# Altium project Motherboard_CMOS_MTJ_Biochip_v1.PrjPCB (part 1 of 2)
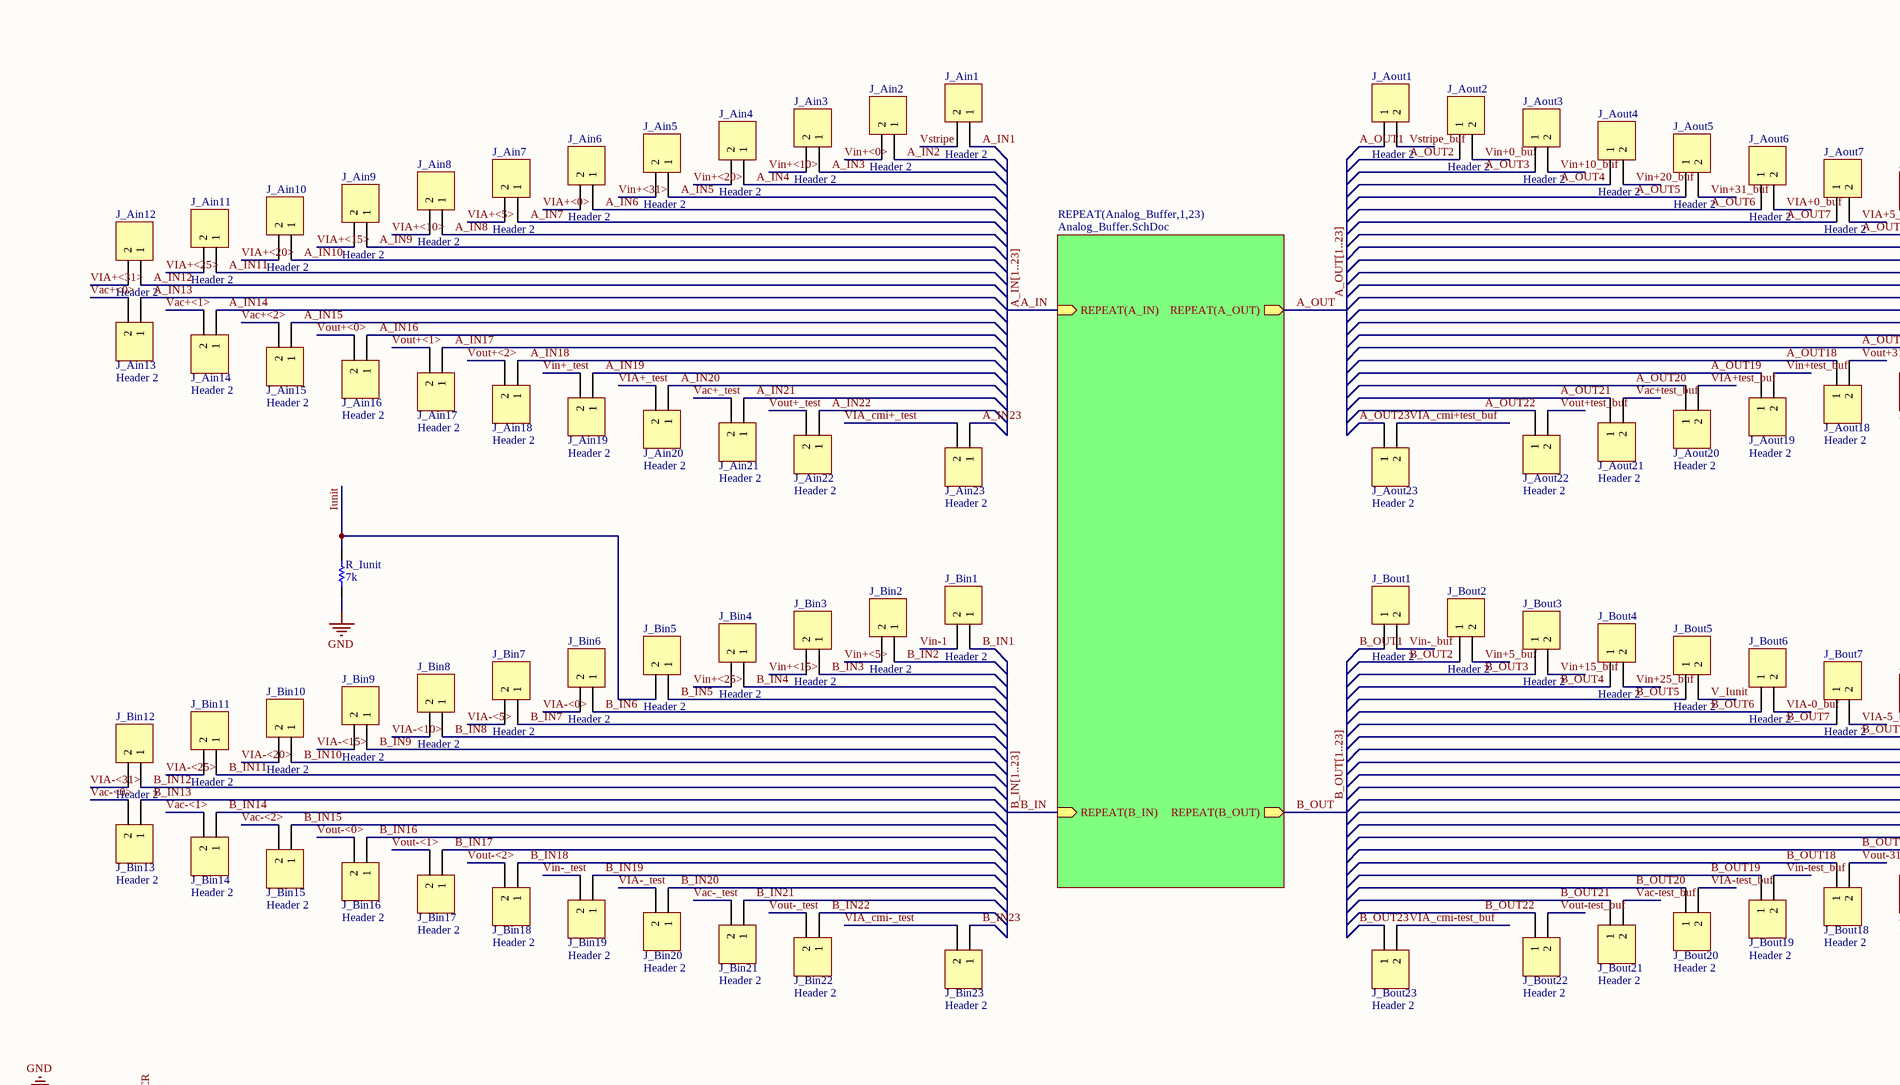
[diagram p0: Top.SchDoc, top left]
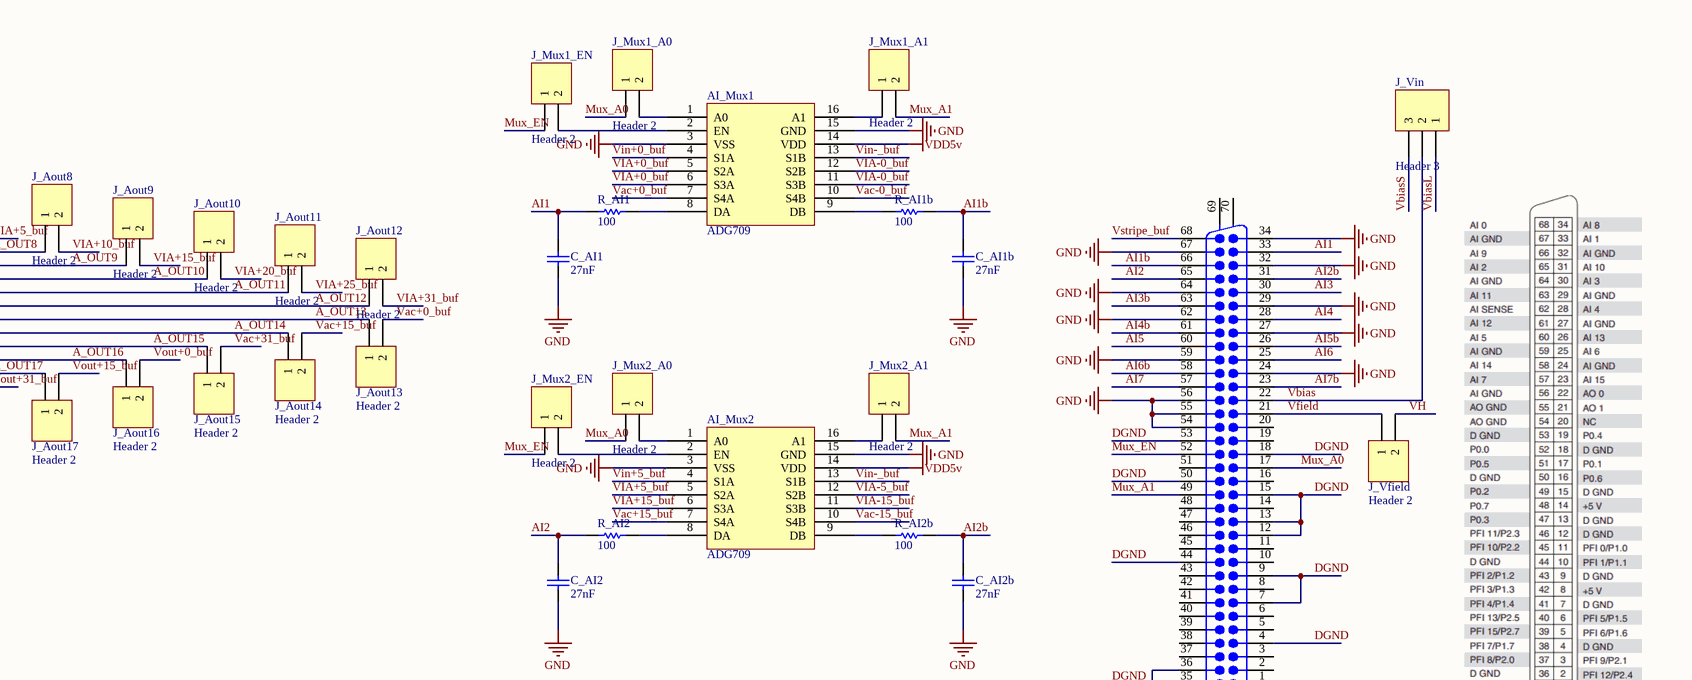
[diagram p1: Top.SchDoc, top right]
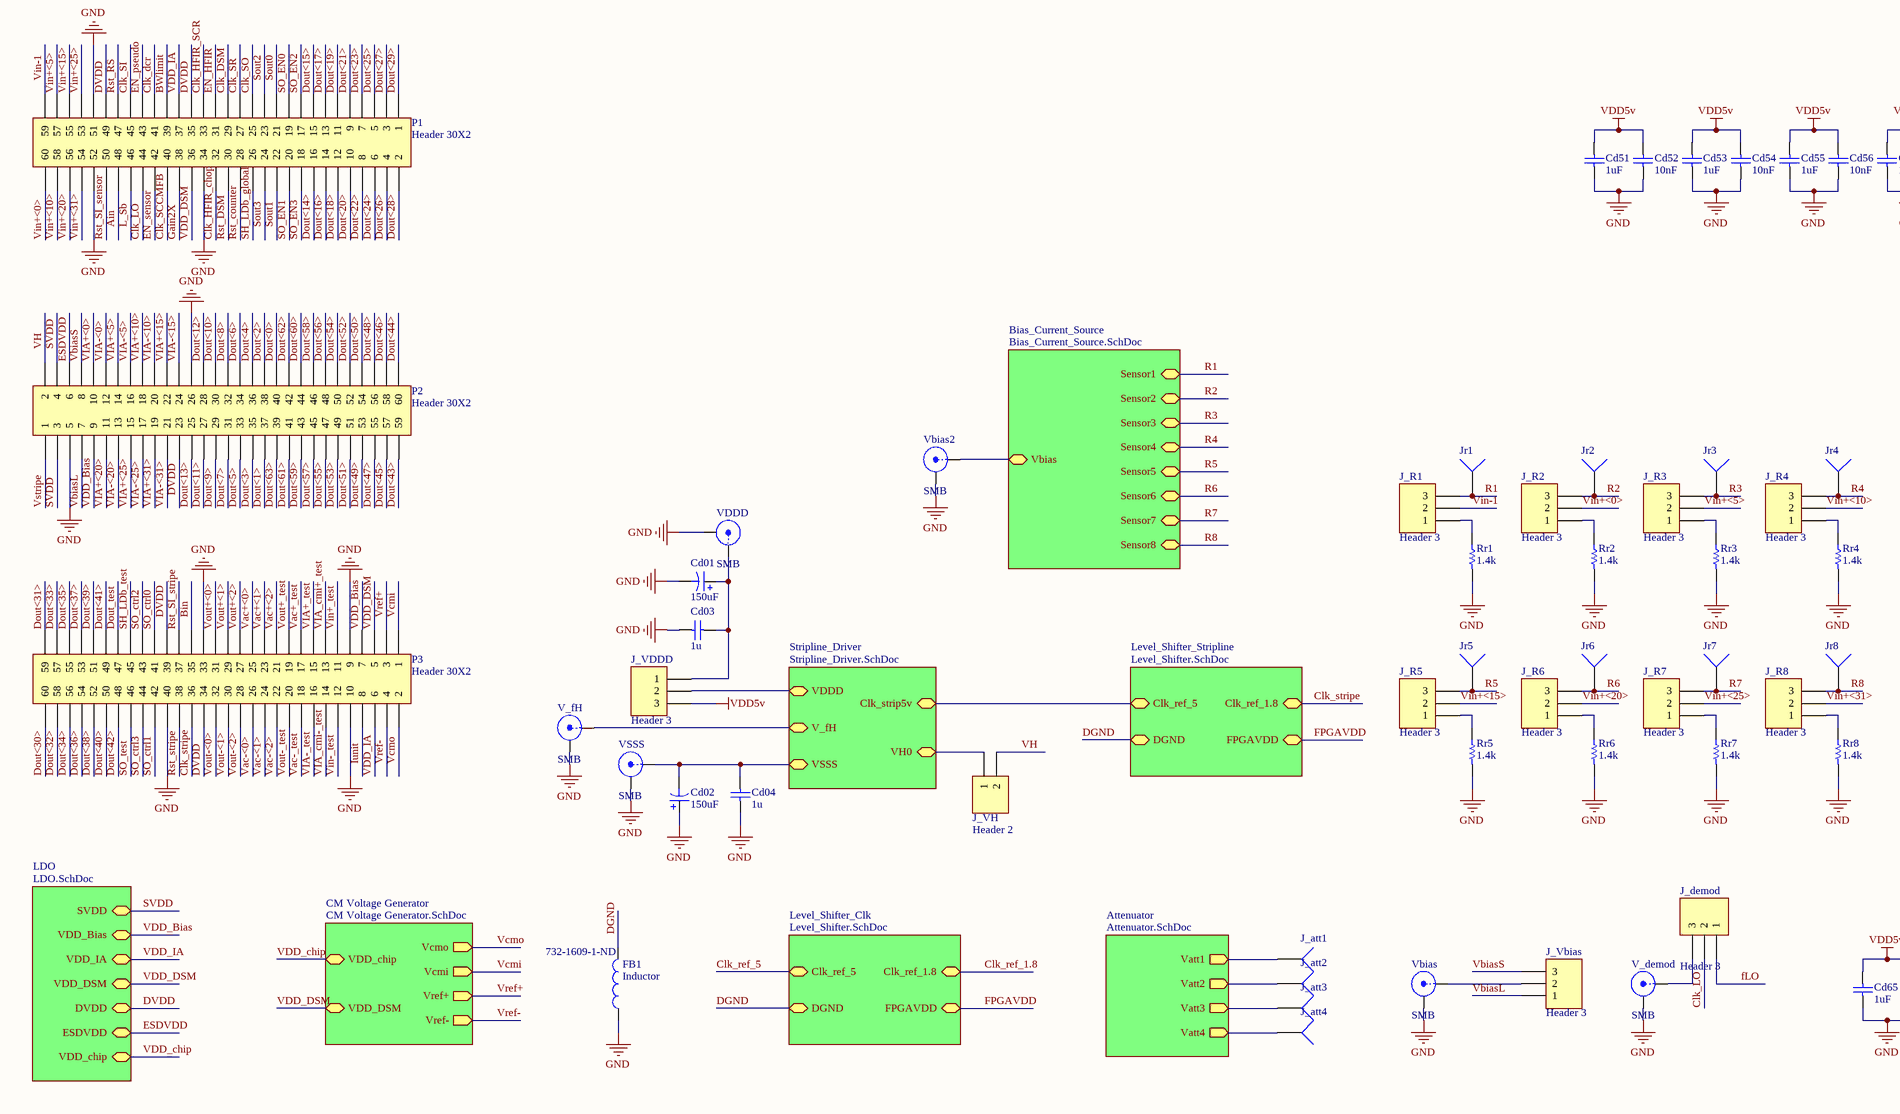
[diagram p2: Top.SchDoc, bottom left]
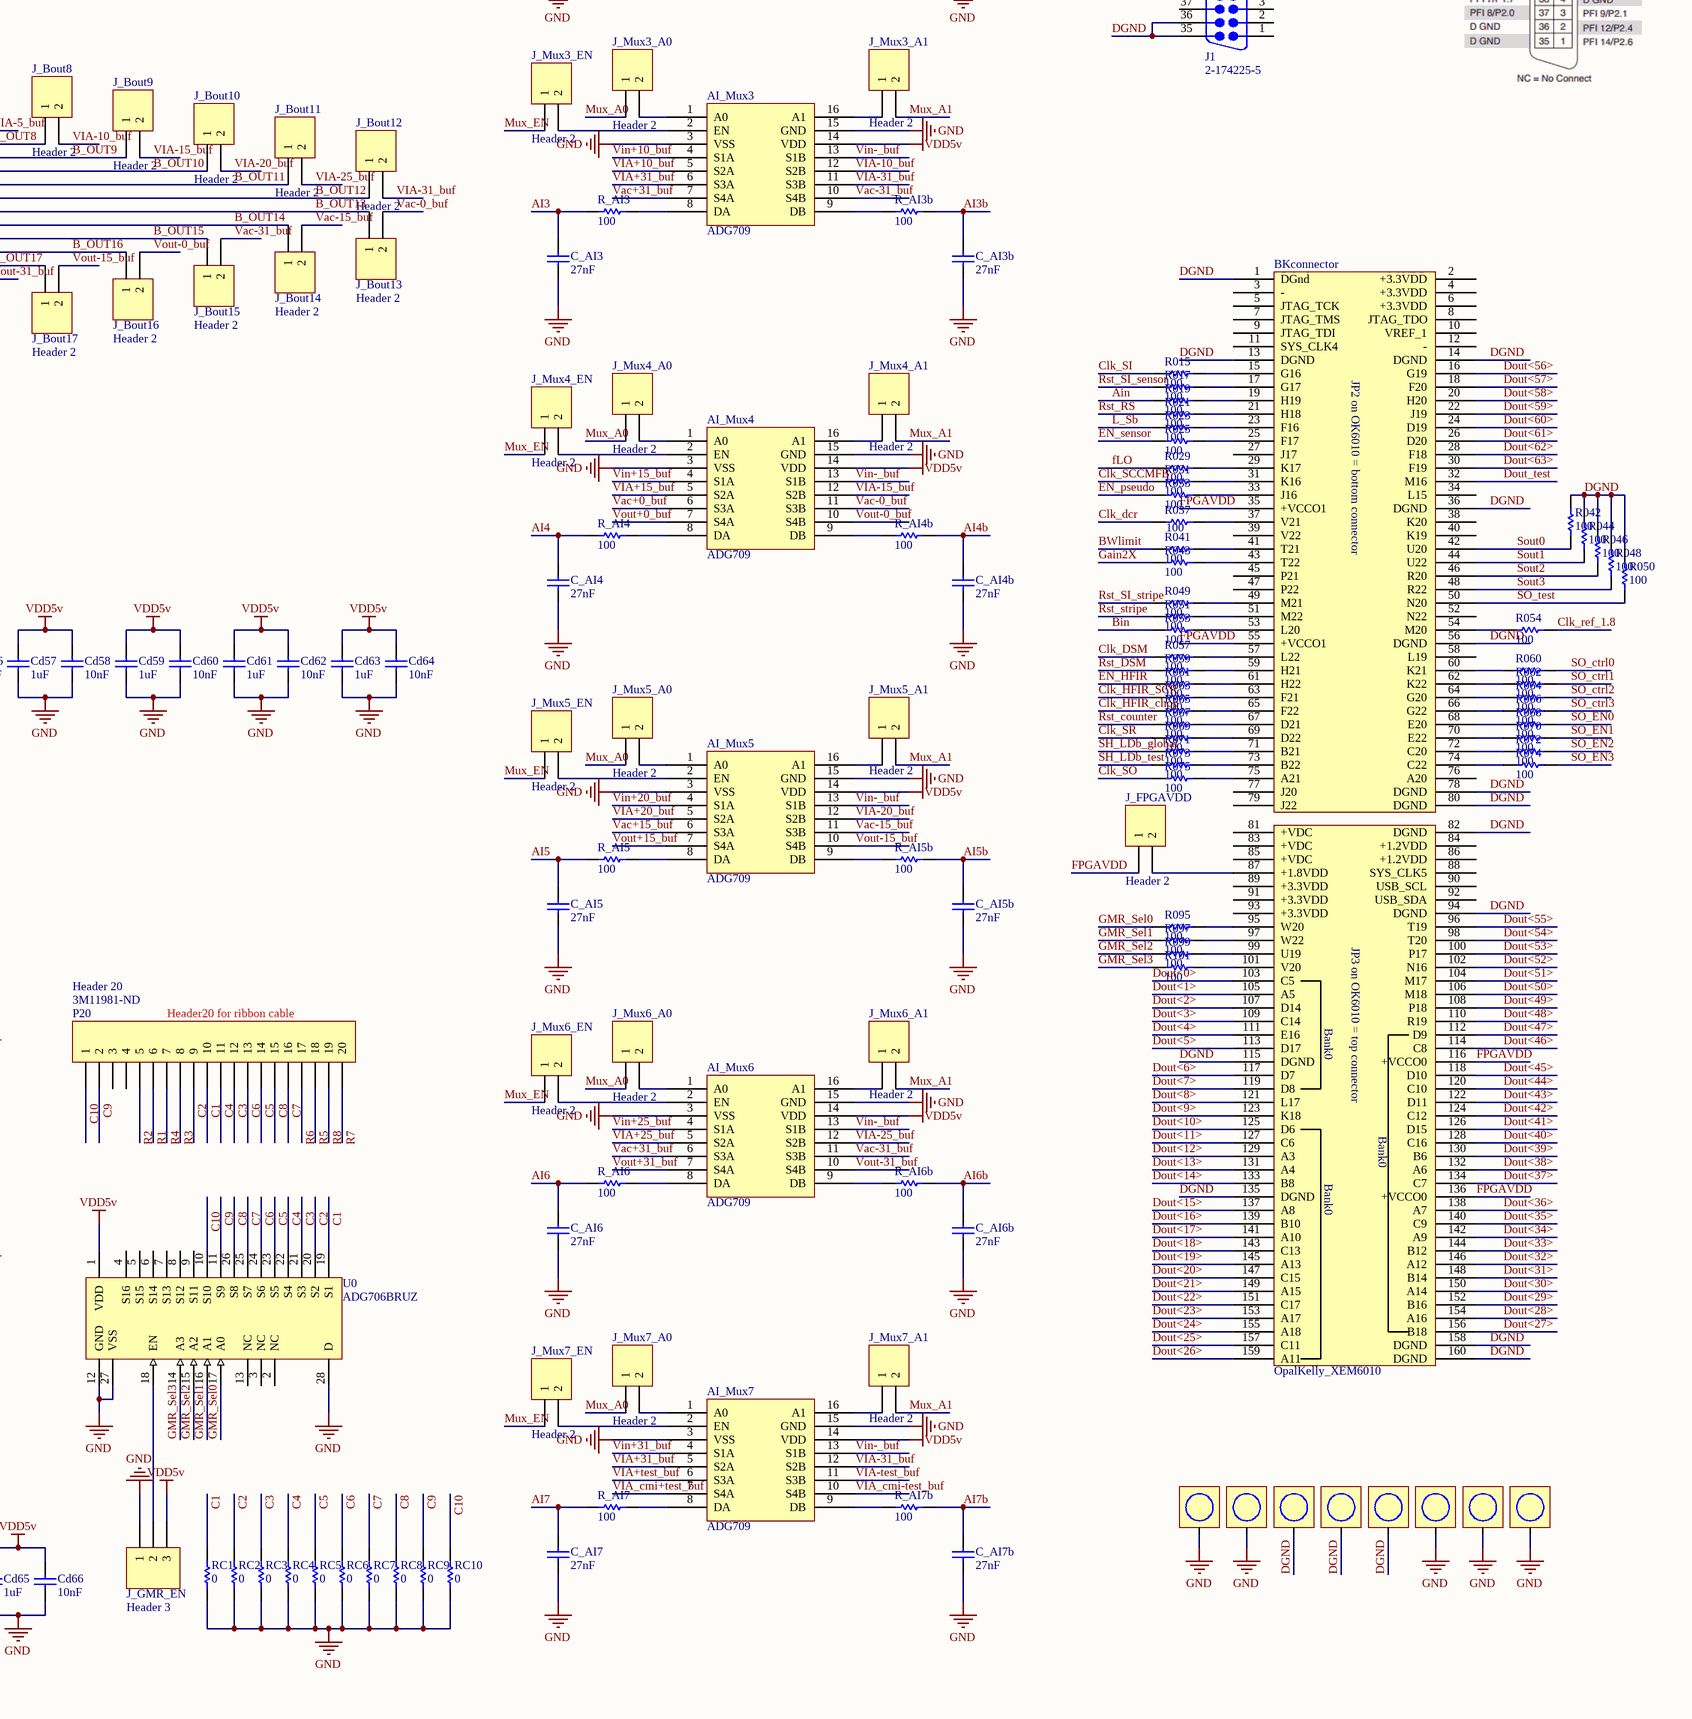
[diagram p3: Top.SchDoc, bottom right]
8 sheets, 647 parts. Net scope: hierarchical (ports join the sheet entries above them; power ports are global).
Board file: Motherboard_CMOS_MTJ_Biochip_v1.PcbDoc
Sheets:
  Top.SchDoc
    LDO = LDO.SchDoc
    CM Voltage Generator = CM Voltage Generator.SchDoc
    Level_Shifter_Clk = Level_Shifter.SchDoc
    Analog_Buffer1 = Analog_Buffer.SchDoc
    Analog_Buffer2 = Analog_Buffer.SchDoc
    Analog_Buffer3 = Analog_Buffer.SchDoc
    Analog_Buffer4 = Analog_Buffer.SchDoc
    Analog_Buffer5 = Analog_Buffer.SchDoc
    Analog_Buffer6 = Analog_Buffer.SchDoc
    Analog_Buffer7 = Analog_Buffer.SchDoc
    Analog_Buffer8 = Analog_Buffer.SchDoc
    Analog_Buffer9 = Analog_Buffer.SchDoc
    Analog_Buffer10 = Analog_Buffer.SchDoc
    Analog_Buffer11 = Analog_Buffer.SchDoc
    Analog_Buffer12 = Analog_Buffer.SchDoc
    Analog_Buffer13 = Analog_Buffer.SchDoc
    Analog_Buffer14 = Analog_Buffer.SchDoc
    Analog_Buffer15 = Analog_Buffer.SchDoc
    Analog_Buffer16 = Analog_Buffer.SchDoc
    Analog_Buffer17 = Analog_Buffer.SchDoc
    Analog_Buffer18 = Analog_Buffer.SchDoc
    Analog_Buffer19 = Analog_Buffer.SchDoc
    Analog_Buffer20 = Analog_Buffer.SchDoc
    Analog_Buffer21 = Analog_Buffer.SchDoc
    Analog_Buffer22 = Analog_Buffer.SchDoc
    Analog_Buffer23 = Analog_Buffer.SchDoc
    Attenuator = Attenuator.SchDoc
    Stripline_Driver = Stripline_Driver.SchDoc
    Level_Shifter_Stripline = Level_Shifter.SchDoc
    Bias_Current_Source = Bias_Current_Source.SchDoc

## Sheet Top.SchDoc
size 711 x 457 mm

### Parts
AI_Mux1  ADG709  [RU-16]
AI_Mux2  ADG709  [RU-16]
AI_Mux3  ADG709  [RU-16]
AI_Mux4  ADG709  [RU-16]
AI_Mux5  ADG709  [RU-16]
AI_Mux6  ADG709  [RU-16]
AI_Mux7  ADG709  [RU-16]
BKconnector  OpalKelly_XEM6010  [OpalKelly_XEM6010]
C_AI1  value 27nF  [1608[0603]]  (hidden comment: Cap)
C_AI1b  value 27nF  [1608[0603]]  (hidden comment: Cap)
C_AI2  value 27nF  [1608[0603]]  (hidden comment: Cap)
C_AI2b  value 27nF  [1608[0603]]  (hidden comment: Cap)
C_AI3  value 27nF  [1608[0603]]  (hidden comment: Cap)
C_AI3b  value 27nF  [1608[0603]]  (hidden comment: Cap)
C_AI4  value 27nF  [1608[0603]]  (hidden comment: Cap)
C_AI4b  value 27nF  [1608[0603]]  (hidden comment: Cap)
C_AI5  value 27nF  [1608[0603]]  (hidden comment: Cap)
C_AI5b  value 27nF  [1608[0603]]  (hidden comment: Cap)
C_AI6  value 27nF  [1608[0603]]  (hidden comment: Cap)
C_AI6b  value 27nF  [1608[0603]]  (hidden comment: Cap)
C_AI7  value 27nF  [1608[0603]]  (hidden comment: Cap)
C_AI7b  value 27nF  [1608[0603]]  (hidden comment: Cap)
Cd01  value 150uF  [C1210_M]  (hidden comment: Cap Pol1)
Cd02  value 150uF  [C1210_M]  (hidden comment: Cap Pol1)
Cd03  value 1u  [6-0805_M]  (hidden comment: Cap)
Cd04  value 1u  [6-0805_M]  (hidden comment: Cap)
Cd51  value 1uF  [1608[0603]]  (hidden comment: Cap)
Cd52  value 10nF  [1608[0603]]  (hidden comment: Cap)
Cd53  value 1uF  [1608[0603]]  (hidden comment: Cap)
Cd54  value 10nF  [1608[0603]]  (hidden comment: Cap)
Cd55  value 1uF  [1608[0603]]  (hidden comment: Cap)
Cd56  value 10nF  [1608[0603]]  (hidden comment: Cap)
Cd57  value 1uF  [1608[0603]]  (hidden comment: Cap)
Cd58  value 10nF  [1608[0603]]  (hidden comment: Cap)
Cd59  value 1uF  [1608[0603]]  (hidden comment: Cap)
Cd60  value 10nF  [1608[0603]]  (hidden comment: Cap)
Cd61  value 1uF  [1608[0603]]  (hidden comment: Cap)
Cd62  value 10nF  [1608[0603]]  (hidden comment: Cap)
Cd63  value 1uF  [1608[0603]]  (hidden comment: Cap)
Cd64  value 10nF  [1608[0603]]  (hidden comment: Cap)
Cd65  value 1uF  [1608[0603]]  (hidden comment: Cap)
Cd66  value 10nF  [1608[0603]]  (hidden comment: Cap)
FB1  Inductor  Supplier Part Number 1: 732-1609-1-ND  [C0805]
H1  Mounting Hole  [MTHole]  (value not drawn)
H2  Mounting Hole  [MTHole]  (value not drawn)
H3  Mounting Hole  [MTHole]  (value not drawn)
H4  Mounting Hole  [MTHole]  (value not drawn)
H5  Mounting Hole  [MTHole]  (value not drawn)
H6  Mounting Hole  [MTHole]  (value not drawn)
H7  Mounting Hole  [MTHole]  (value not drawn)
H8  Mounting Hole  [MTHole]  (value not drawn)
J1  2-174225-5  [2-174225-5]
J_Ain1  Header 2  [HDR1X2]
J_Ain2  Header 2  [HDR1X2]
J_Ain3  Header 2  [HDR1X2]
J_Ain4  Header 2  [HDR1X2]
J_Ain5  Header 2  [HDR1X2]
J_Ain6  Header 2  [HDR1X2]
J_Ain7  Header 2  [HDR1X2]
J_Ain8  Header 2  [HDR1X2]
J_Ain9  Header 2  [HDR1X2]
J_Ain10  Header 2  [HDR1X2]
J_Ain11  Header 2  [HDR1X2]
J_Ain12  Header 2  [HDR1X2]
J_Ain13  Header 2  [HDR1X2]
J_Ain14  Header 2  [HDR1X2]
J_Ain15  Header 2  [HDR1X2]
J_Ain16  Header 2  [HDR1X2]
J_Ain17  Header 2  [HDR1X2]
J_Ain18  Header 2  [HDR1X2]
J_Ain19  Header 2  [HDR1X2]
J_Ain20  Header 2  [HDR1X2]
J_Ain21  Header 2  [HDR1X2]
J_Ain22  Header 2  [HDR1X2]
J_Ain23  Header 2  [HDR1X2]
J_Aout1  Header 2  [HDR1X2]
J_Aout2  Header 2  [HDR1X2]
J_Aout3  Header 2  [HDR1X2]
J_Aout4  Header 2  [HDR1X2]
J_Aout5  Header 2  [HDR1X2]
J_Aout6  Header 2  [HDR1X2]
J_Aout7  Header 2  [HDR1X2]
J_Aout8  Header 2  [HDR1X2]
J_Aout9  Header 2  [HDR1X2]
J_Aout10  Header 2  [HDR1X2]
J_Aout11  Header 2  [HDR1X2]
J_Aout12  Header 2  [HDR1X2]
J_Aout13  Header 2  [HDR1X2]
J_Aout14  Header 2  [HDR1X2]
J_Aout15  Header 2  [HDR1X2]
J_Aout16  Header 2  [HDR1X2]
J_Aout17  Header 2  [HDR1X2]
J_Aout18  Header 2  [HDR1X2]
J_Aout19  Header 2  [HDR1X2]
J_Aout20  Header 2  [HDR1X2]
J_Aout21  Header 2  [HDR1X2]
J_Aout22  Header 2  [HDR1X2]
J_Aout23  Header 2  [HDR1X2]
J_att1  Socket  [PIN1]  (value not drawn)
J_att2  Socket  [PIN1]  (value not drawn)
J_att3  Socket  [PIN1]  (value not drawn)
J_att4  Socket  [PIN1]  (value not drawn)
J_Bin1  Header 2  [HDR1X2]
J_Bin2  Header 2  [HDR1X2]
J_Bin3  Header 2  [HDR1X2]
J_Bin4  Header 2  [HDR1X2]
J_Bin5  Header 2  [HDR1X2]
J_Bin6  Header 2  [HDR1X2]
J_Bin7  Header 2  [HDR1X2]
J_Bin8  Header 2  [HDR1X2]
J_Bin9  Header 2  [HDR1X2]
J_Bin10  Header 2  [HDR1X2]
J_Bin11  Header 2  [HDR1X2]
J_Bin12  Header 2  [HDR1X2]
J_Bin13  Header 2  [HDR1X2]
J_Bin14  Header 2  [HDR1X2]
J_Bin15  Header 2  [HDR1X2]
J_Bin16  Header 2  [HDR1X2]
J_Bin17  Header 2  [HDR1X2]
J_Bin18  Header 2  [HDR1X2]
J_Bin19  Header 2  [HDR1X2]
J_Bin20  Header 2  [HDR1X2]
J_Bin21  Header 2  [HDR1X2]
J_Bin22  Header 2  [HDR1X2]
J_Bin23  Header 2  [HDR1X2]
J_Bout1  Header 2  [HDR1X2]
J_Bout2  Header 2  [HDR1X2]
J_Bout3  Header 2  [HDR1X2]
J_Bout4  Header 2  [HDR1X2]
J_Bout5  Header 2  [HDR1X2]
J_Bout6  Header 2  [HDR1X2]
J_Bout7  Header 2  [HDR1X2]
J_Bout8  Header 2  [HDR1X2]
J_Bout9  Header 2  [HDR1X2]
J_Bout10  Header 2  [HDR1X2]
J_Bout11  Header 2  [HDR1X2]
J_Bout12  Header 2  [HDR1X2]
J_Bout13  Header 2  [HDR1X2]
J_Bout14  Header 2  [HDR1X2]
J_Bout15  Header 2  [HDR1X2]
J_Bout16  Header 2  [HDR1X2]
J_Bout17  Header 2  [HDR1X2]
J_Bout18  Header 2  [HDR1X2]
J_Bout19  Header 2  [HDR1X2]
J_Bout20  Header 2  [HDR1X2]
J_Bout21  Header 2  [HDR1X2]
J_Bout22  Header 2  [HDR1X2]
J_Bout23  Header 2  [HDR1X2]
J_demod  Header 3  [HDR1X3]
J_FPGAVDD  Header 2  [HDR1X2]
J_GMR_EN  Header 3  [HDR1X3]
J_Mux1_A0  Header 2  [HDR1X2]
J_Mux1_A1  Header 2  [HDR1X2]
J_Mux1_EN  Header 2  [HDR1X2]
J_Mux2_A0  Header 2  [HDR1X2]
J_Mux2_A1  Header 2  [HDR1X2]
J_Mux2_EN  Header 2  [HDR1X2]
J_Mux3_A0  Header 2  [HDR1X2]
J_Mux3_A1  Header 2  [HDR1X2]
J_Mux3_EN  Header 2  [HDR1X2]
J_Mux4_A0  Header 2  [HDR1X2]
J_Mux4_A1  Header 2  [HDR1X2]
J_Mux4_EN  Header 2  [HDR1X2]
J_Mux5_A0  Header 2  [HDR1X2]
J_Mux5_A1  Header 2  [HDR1X2]
J_Mux5_EN  Header 2  [HDR1X2]
J_Mux6_A0  Header 2  [HDR1X2]
J_Mux6_A1  Header 2  [HDR1X2]
J_Mux6_EN  Header 2  [HDR1X2]
J_Mux7_A0  Header 2  [HDR1X2]
J_Mux7_A1  Header 2  [HDR1X2]
J_Mux7_EN  Header 2  [HDR1X2]
J_R1  Header 3  [HDR1X3]
J_R2  Header 3  [HDR1X3]
J_R3  Header 3  [HDR1X3]
J_R4  Header 3  [HDR1X3]
J_R5  Header 3  [HDR1X3]
J_R6  Header 3  [HDR1X3]
J_R7  Header 3  [HDR1X3]
J_R8  Header 3  [HDR1X3]
J_Vbias  Header 3  [HDR1X3]
J_VDDD  Header 3  [HDR1X3]
J_Vfield  Header 2  [HDR1X2]
J_VH  Header 2  [HDR1X2]
J_Vin  Header 3  [HDR1X3]
Jr1  Socket  [PIN1]  (value not drawn)
Jr2  Socket  [PIN1]  (value not drawn)
Jr3  Socket  [PIN1]  (value not drawn)
Jr4  Socket  [PIN1]  (value not drawn)
Jr5  Socket  [PIN1]  (value not drawn)
Jr6  Socket  [PIN1]  (value not drawn)
Jr7  Socket  [PIN1]  (value not drawn)
Jr8  Socket  [PIN1]  (value not drawn)
P1  Header 30X2  [HDR2X30]
P2  Header 30X2  [HDR2X30]
P3  Header 30X2  [HDR2X30]
P20  Header 20  Supplier Part Number 1: 3M11981-ND  [HDR2X10]
R015  value 100  [1608[0603]]  (hidden comment: Res1)
R017  value 100  [1608[0603]]  (hidden comment: Res1)
R019  value 100  [1608[0603]]  (hidden comment: Res1)
R021  value 100  [1608[0603]]  (hidden comment: Res1)
R023  value 100  [1608[0603]]  (hidden comment: Res1)
R025  value 100  [1608[0603]]  (hidden comment: Res1)
R029  value 100  [1608[0603]]  (hidden comment: Res1)
R031  value 100  [1608[0603]]  (hidden comment: Res1)
R033  value 100  [1608[0603]]  (hidden comment: Res1)
R037  value 100  [1608[0603]]  (hidden comment: Res1)
R041  value 100  [1608[0603]]  (hidden comment: Res1)
R042  value 100  [1608[0603]]  (hidden comment: Res1)
R043  value 100  [1608[0603]]  (hidden comment: Res1)
R044  value 100  [1608[0603]]  (hidden comment: Res1)
R046  value 100  [1608[0603]]  (hidden comment: Res1)
R048  value 100  [1608[0603]]  (hidden comment: Res1)
R049  value 100  [1608[0603]]  (hidden comment: Res1)
R050  value 100  [1608[0603]]  (hidden comment: Res1)
R051  value 100  [1608[0603]]  (hidden comment: Res1)
R053  value 100  [1608[0603]]  (hidden comment: Res1)
R054  value 100  [1608[0603]]  (hidden comment: Res1)
R057  value 100  [1608[0603]]  (hidden comment: Res1)
R059  value 100  [1608[0603]]  (hidden comment: Res1)
R060  value 100  [1608[0603]]  (hidden comment: Res1)
R061  value 100  [1608[0603]]  (hidden comment: Res1)
R062  value 100  [1608[0603]]  (hidden comment: Res1)
R063  value 100  [1608[0603]]  (hidden comment: Res1)
R064  value 100  [1608[0603]]  (hidden comment: Res1)
R065  value 100  [1608[0603]]  (hidden comment: Res1)
R066  value 100  [1608[0603]]  (hidden comment: Res1)
R067  value 100  [1608[0603]]  (hidden comment: Res1)
R068  value 100  [1608[0603]]  (hidden comment: Res1)
R069  value 100  [1608[0603]]  (hidden comment: Res1)
R070  value 100  [1608[0603]]  (hidden comment: Res1)
R071  value 100  [1608[0603]]  (hidden comment: Res1)
R072  value 100  [1608[0603]]  (hidden comment: Res1)
R073  value 100  [1608[0603]]  (hidden comment: Res1)
R074  value 100  [1608[0603]]  (hidden comment: Res1)
R075  value 100  [1608[0603]]  (hidden comment: Res1)
R095  value 100  [1608[0603]]  (hidden comment: Res1)
R097  value 100  [1608[0603]]  (hidden comment: Res1)
R099  value 100  [1608[0603]]  (hidden comment: Res1)
R101  value 100  [1608[0603]]  (hidden comment: Res1)
R_AI1  value 100  [1608[0603]]  (hidden comment: Res1)
R_AI1b  value 100  [1608[0603]]  (hidden comment: Res1)
R_AI2  value 100  [1608[0603]]  (hidden comment: Res1)
R_AI2b  value 100  [1608[0603]]  (hidden comment: Res1)
R_AI3  value 100  [1608[0603]]  (hidden comment: Res1)
R_AI3b  value 100  [1608[0603]]  (hidden comment: Res1)
R_AI4  value 100  [1608[0603]]  (hidden comment: Res1)
R_AI4b  value 100  [1608[0603]]  (hidden comment: Res1)
R_AI5  value 100  [1608[0603]]  (hidden comment: Res1)
R_AI5b  value 100  [1608[0603]]  (hidden comment: Res1)
R_AI6  value 100  [1608[0603]]  (hidden comment: Res1)
R_AI6b  value 100  [1608[0603]]  (hidden comment: Res1)
R_AI7  value 100  [1608[0603]]  (hidden comment: Res1)
R_AI7b  value 100  [1608[0603]]  (hidden comment: Res1)
R_Iunit  value 7k  [1608[0603]]  (hidden comment: Res1)
RC1  value 0  [1608[0603]]  (hidden comment: Res1)
RC2  value 0  [1608[0603]]  (hidden comment: Res1)
RC3  value 0  [1608[0603]]  (hidden comment: Res1)
RC4  value 0  [1608[0603]]  (hidden comment: Res1)
RC5  value 0  [1608[0603]]  (hidden comment: Res1)
RC6  value 0  [1608[0603]]  (hidden comment: Res1)
RC7  value 0  [1608[0603]]  (hidden comment: Res1)
RC8  value 0  [1608[0603]]  (hidden comment: Res1)
RC9  value 0  [1608[0603]]  (hidden comment: Res1)
RC10  value 0  [1608[0603]]  (hidden comment: Res1)
Rr1  value 1.4k  [1608[0603]]  (hidden comment: Res1)
Rr2  value 1.4k  [1608[0603]]  (hidden comment: Res1)
Rr3  value 1.4k  [1608[0603]]  (hidden comment: Res1)
Rr4  value 1.4k  [1608[0603]]  (hidden comment: Res1)
Rr5  value 1.4k  [1608[0603]]  (hidden comment: Res1)
Rr6  value 1.4k  [1608[0603]]  (hidden comment: Res1)
Rr7  value 1.4k  [1608[0603]]  (hidden comment: Res1)
Rr8  value 1.4k  [1608[0603]]  (hidden comment: Res1)
U0  ADG706BRUZ  [ADI-RU-28_N]
V_demod  SMB  [SMB_V-RJ45]
V_fH  SMB  [SMB_V-RJ45]
Vbias  SMB  [SMB_V-RJ45]
Vbias2  SMB  [SMB_V-RJ45]
VDDD  SMB  [SMB_V-RJ45]
VSSS  SMB  [SMB_V-RJ45]

### Sub-sheets
Attenuator = Attenuator.SchDoc: Vatt1 (out), Vatt2 (out), Vatt3 (out), Vatt4 (out)
Bias_Current_Source = Bias_Current_Source.SchDoc: Vbias (bidir), Sensor1 (bidir), Sensor2 (bidir), Sensor3 (bidir), Sensor4 (bidir), Sensor5 (bidir), Sensor6 (bidir), Sensor7 (bidir), Sensor8 (bidir)
CM Voltage Generator = CM Voltage Generator.SchDoc: Vcmo (out), Vcmi (out), VDD_chip (bidir), VDD_DSM (bidir), Vref+ (out), Vref- (out)
LDO = LDO.SchDoc: VDD_IA (bidir), DVDD (bidir), ESDVDD (bidir), VDD_Bias (bidir), SVDD (bidir), VDD_DSM (bidir), VDD_chip (bidir)
Level_Shifter_Clk = Level_Shifter.SchDoc: Clk_ref_5 (bidir), Clk_ref_1.8 (bidir), DGND (bidir), FPGAVDD (bidir)
Level_Shifter_Stripline = Level_Shifter.SchDoc: Clk_ref_5 (bidir), Clk_ref_1.8 (bidir), DGND (bidir), FPGAVDD (bidir)
REPEAT(Analog_Buffer,1,23) = Analog_Buffer.SchDoc: REPEAT(A_IN) (in), REPEAT(B_IN) (in), REPEAT(A_OUT) (out), REPEAT(B_OUT) (out)
Stripline_Driver = Stripline_Driver.SchDoc: VDDD (bidir), V_fH (bidir), VSSS (bidir), Clk_strip5v, VH0

### Nets
GND: AI_Mux1.3(VSS) AI_Mux1.15(GND) AI_Mux2.3(VSS) AI_Mux2.15(GND) AI_Mux3.3(VSS) AI_Mux3.15(GND) AI_Mux4.3(VSS) AI_Mux4.15(GND) AI_Mux5.3(VSS) AI_Mux5.15(GND) AI_Mux6.3(VSS) AI_Mux6.15(GND) AI_Mux7.3(VSS) AI_Mux7.15(GND) C_AI1.2 C_AI1b.2 C_AI2.2 C_AI2b.2 C_AI3.2 C_AI3b.2 C_AI4.2 C_AI4b.2 C_AI5.2 C_AI5b.2 C_AI6.2 C_AI6b.2 C_AI7.2 C_AI7b.2 Cd01.2 Cd02.1 Cd03.1 Cd04.1 Cd51.2 Cd52.2 Cd53.2 Cd54.2 Cd55.2 Cd56.2 Cd57.2 Cd58.2 Cd59.2 Cd60.2 Cd61.2 Cd62.2 Cd63.2 Cd64.2 Cd65.2 Cd66.2 FB1.1 H1.1 H2.1 H6.1 H7.1 H8.1 J1.24 J1.27 J1.29 J1.32 J1.34 J1.54 J1.55 J1.56 J1.59 J1.62 J1.64 J1.67 J_GMR_EN.1 P1.34 P1.51 P1.52 P2.5 P2.26 P3.9 P3.10 P3.33 P3.40 R_Iunit.2 RC1.1 RC2.1 RC3.1 RC4.1 RC5.1 RC6.1 RC7.1 RC8.1 RC9.1 RC10.1 Rr1.2 Rr2.2 Rr3.2 Rr4.2 Rr5.2 Rr6.2 Rr7.2 Rr8.2 U0.12(GND) U0.27(VSS) U0.28(D) V_demod.2(Y) V_fH.2(Y) Vbias.2(Y) Vbias2.2(Y) VDDD.2(Y) VSSS.2(Y)
VDD5v: AI_Mux1.14(VDD) AI_Mux2.14(VDD) AI_Mux3.14(VDD) AI_Mux4.14(VDD) AI_Mux5.14(VDD) AI_Mux6.14(VDD) AI_Mux7.14(VDD) Cd51.1 Cd52.1 Cd53.1 Cd54.1 Cd55.1 Cd56.1 Cd57.1 Cd58.1 Cd59.1 Cd60.1 Cd61.1 Cd62.1 Cd63.1 Cd64.1 Cd65.1 Cd66.1 J_GMR_EN.3 J_VDDD.3 U0.1(VDD)
A_IN: sheet REPEAT(Analog_Buffer,1,23)/REPEAT(A_IN)
A_IN1: J_Ain1.1
A_IN2: J_Ain2.1
A_IN3: J_Ain3.1
A_IN4: J_Ain4.1
A_IN5: J_Ain5.1
A_IN6: J_Ain6.1
A_IN7: J_Ain7.1
A_IN8: J_Ain8.1
A_IN9: J_Ain9.1
A_IN10: J_Ain10.1
A_IN11: J_Ain11.1
A_IN12: J_Ain12.1
A_IN13: J_Ain13.1
A_IN14: J_Ain14.1
A_IN15: J_Ain15.1
A_IN16: J_Ain16.1
A_IN17: J_Ain17.1
A_IN18: J_Ain18.1
A_IN19: J_Ain19.1
A_IN20: J_Ain20.1
A_IN21: J_Ain21.1
A_IN22: J_Ain22.1
A_IN23: J_Ain23.1
A_OUT: sheet REPEAT(Analog_Buffer,1,23)/REPEAT(A_OUT)
A_OUT1: J_Aout1.1
A_OUT2: J_Aout2.1
A_OUT3: J_Aout3.1
A_OUT4: J_Aout4.1
A_OUT5: J_Aout5.1
A_OUT6: J_Aout6.1
A_OUT7: J_Aout7.1
A_OUT8: J_Aout8.1
A_OUT9: J_Aout9.1
A_OUT10: J_Aout10.1
A_OUT11: J_Aout11.1
A_OUT12: J_Aout12.1
A_OUT13: J_Aout13.1
A_OUT14: J_Aout14.1
A_OUT15: J_Aout15.1
A_OUT16: J_Aout16.1
A_OUT17: J_Aout17.1
A_OUT18: J_Aout18.1
A_OUT19: J_Aout19.1
A_OUT20: J_Aout20.1
A_OUT21: J_Aout21.1
A_OUT22: J_Aout22.1
A_OUT23: J_Aout23.1
AI1: C_AI1.1 J1.33 R_AI1.1
AI1b: C_AI1b.1 J1.66 R_AI1b.2
AI2: C_AI2.1 J1.65 R_AI2.1
AI2b: C_AI2b.1 J1.31 R_AI2b.2
AI3: C_AI3.1 J1.30 R_AI3.1
AI3b: C_AI3b.1 J1.63 R_AI3b.2
AI4: C_AI4.1 J1.28 R_AI4.1
AI4b: C_AI4b.1 J1.61 R_AI4b.2
AI5: C_AI5.1 J1.60 R_AI5.1
AI5b: C_AI5b.1 J1.26 R_AI5b.2
AI6: C_AI6.1 J1.25 R_AI6.1
AI6b: C_AI6b.1 J1.58 R_AI6b.2
AI7: C_AI7.1 J1.57 R_AI7.1
AI7b: C_AI7b.1 J1.23 R_AI7b.2
Ain: P1.48 R019.1
B_IN: sheet REPEAT(Analog_Buffer,1,23)/REPEAT(B_IN)
B_IN1: J_Bin1.1
B_IN2: J_Bin2.1
B_IN3: J_Bin3.1
B_IN4: J_Bin4.1
B_IN5: J_Bin5.1
B_IN6: J_Bin6.1
B_IN7: J_Bin7.1
B_IN8: J_Bin8.1
B_IN9: J_Bin9.1
B_IN10: J_Bin10.1
B_IN11: J_Bin11.1
B_IN12: J_Bin12.1
B_IN13: J_Bin13.1
B_IN14: J_Bin14.1
B_IN15: J_Bin15.1
B_IN16: J_Bin16.1
B_IN17: J_Bin17.1
B_IN18: J_Bin18.1
B_IN19: J_Bin19.1
B_IN20: J_Bin20.1
B_IN21: J_Bin21.1
B_IN22: J_Bin22.1
B_IN23: J_Bin23.1
B_OUT: sheet REPEAT(Analog_Buffer,1,23)/REPEAT(B_OUT)
B_OUT1: J_Bout1.1
B_OUT2: J_Bout2.1
B_OUT3: J_Bout3.1
B_OUT4: J_Bout4.1
B_OUT5: J_Bout5.1
B_OUT6: J_Bout6.1
B_OUT7: J_Bout7.1
B_OUT8: J_Bout8.1
B_OUT9: J_Bout9.1
B_OUT10: J_Bout10.1
B_OUT11: J_Bout11.1
B_OUT12: J_Bout12.1
B_OUT13: J_Bout13.1
B_OUT14: J_Bout14.1
B_OUT15: J_Bout15.1
B_OUT16: J_Bout16.1
B_OUT17: J_Bout17.1
B_OUT18: J_Bout18.1
B_OUT19: J_Bout19.1
B_OUT20: J_Bout20.1
B_OUT21: J_Bout21.1
B_OUT22: J_Bout22.1
B_OUT23: J_Bout23.1
Bin: P3.35 R053.1
BWlimit: P1.39 R041.1
C1: P20.10 RC1.2 U0.19(S1)
C2: P20.9 RC2.2 U0.20(S2)
C3: P20.12 RC3.2 U0.21(S3)
C4: P20.11 RC4.2 U0.22(S4)
C5: P20.14 RC5.2 U0.23(S5)
C6: P20.13 RC6.2 U0.24(S6)
C7: P20.16 RC7.2 U0.25(S7)
C8: P20.15 RC8.2 U0.26(S8)
C9: P20.2 RC9.2 U0.11(S9)
C10: P20.1 RC10.2 U0.10(S10)
Clk_dcr: P1.41 R037.1
Clk_DSM: P1.29 R057.1
Clk_HFIR_chop: P1.32 R065.1
Clk_HFIR_SCR: P1.33 R063.1
Clk_LO: J_demod.2 P1.44
Clk_ref_1.8: R054.2 ; sheet Level_Shifter_Clk/Clk_ref_1.8
Clk_SCCMFB: P1.40 R031.1
Clk_SI: P1.45 R015.1
Clk_SO: P1.25 R075.1
Clk_SR: P1.27 R069.1
Clk_strip5v: sheet Stripline_Driver/Clk_strip5v, sheet Level_Shifter_Stripline/Clk_ref_5
Clk_stripe: P3.36 ; sheet Level_Shifter_Stripline/Clk_ref_1.8
DGND: BKconnector.1(DGnd) BKconnector.13(DGND) BKconnector.14(DGND) BKconnector.36(DGND) BKconnector.56(DGND) BKconnector.78(DGND) BKconnector.80(DGND) BKconnector.82(DGND) BKconnector.94(DGND) BKconnector.115(DGND) BKconnector.135(DGND) BKconnector.158(DGND) BKconnector.160(DGND) FB1.2 H3.1 H4.1 H5.1 J1.4 J1.7 J1.9 J1.12 J1.13 J1.15 J1.18 J1.35 J1.36 J1.44 J1.50 J1.53 R042.2 R044.2 R046.2 R048.2 R050.2 ; sheet Level_Shifter_Clk/DGND, sheet Level_Shifter_Stripline/DGND
Dout<0>: BKconnector.103(C5) P2.40
Dout<1>: BKconnector.105(A5) P2.37
Dout<2>: BKconnector.107(D14) P2.38
Dout<3>: BKconnector.109(C14) P2.35
Dout<4>: BKconnector.111(E16) P2.36
Dout<5>: BKconnector.113(D17) P2.33
Dout<6>: BKconnector.117(D7) P2.34
Dout<7>: BKconnector.119(D8) P2.31
Dout<8>: BKconnector.121(L17) P2.32
Dout<9>: BKconnector.123(K18) P2.29
Dout<10>: BKconnector.125(D6) P2.30
Dout<11>: BKconnector.127(C6) P2.27
Dout<12>: BKconnector.129(A3) P2.28
Dout<13>: BKconnector.131(A4) P2.25
Dout<14>: BKconnector.133(B8) P1.16
Dout<15>: BKconnector.137(A8) P1.15
Dout<16>: BKconnector.139(B10) P1.14
Dout<17>: BKconnector.141(A10) P1.13
Dout<18>: BKconnector.143(C13) P1.12
Dout<19>: BKconnector.145(A13) P1.11
Dout<20>: BKconnector.147(C15) P1.10
Dout<21>: BKconnector.149(A15) P1.9
Dout<22>: BKconnector.151(C17) P1.8
Dout<23>: BKconnector.153(A17) P1.7
Dout<24>: BKconnector.155(A18) P1.6
Dout<25>: BKconnector.157(C11) P1.5
Dout<26>: BKconnector.159(A11) P1.4
Dout<27>: BKconnector.156(B18) P1.3
Dout<28>: BKconnector.154(A16) P1.2
Dout<29>: BKconnector.152(B16) P1.1
Dout<30>: BKconnector.150(A14) P3.60
Dout<31>: BKconnector.148(B14) P3.59
Dout<32>: BKconnector.146(A12) P3.58
Dout<33>: BKconnector.144(B12) P3.57
Dout<34>: BKconnector.142(A9) P3.56
Dout<35>: BKconnector.140(C9) P3.55
Dout<36>: BKconnector.138(A7) P3.54
Dout<37>: BKconnector.134(C7) P3.53
Dout<38>: BKconnector.132(A6) P3.52
Dout<39>: BKconnector.130(B6) P3.51
Dout<40>: BKconnector.128(C16) P3.50
Dout<41>: BKconnector.126(D15) P3.49
Dout<42>: BKconnector.124(C12) P3.48
Dout<43>: BKconnector.122(D11) P2.59
Dout<44>: BKconnector.120(C10) P2.60
Dout<45>: BKconnector.118(D10) P2.57
Dout<46>: BKconnector.114(C8) P2.58
Dout<47>: BKconnector.112(D9) P2.55
Dout<48>: BKconnector.110(R19) P2.56
Dout<49>: BKconnector.108(P18) P2.53
Dout<50>: BKconnector.106(M18) P2.54
Dout<51>: BKconnector.104(M17) P2.51
Dout<52>: BKconnector.102(N16) P2.52
Dout<53>: BKconnector.100(P17) P2.49
Dout<54>: BKconnector.98(T20) P2.50
Dout<55>: BKconnector.96(T19) P2.47
Dout<56>: BKconnector.16(G19) P2.48
Dout<57>: BKconnector.18(F20) P2.45
Dout<58>: BKconnector.20(H20) P2.46
Dout<59>: BKconnector.22(J19) P2.43
Dout<60>: BKconnector.24(D19) P2.44
Dout<61>: BKconnector.26(D20) P2.41
Dout<62>: BKconnector.28(F18) P2.42
Dout<63>: BKconnector.30(F19) P2.39
Dout_test: BKconnector.32(M16) P3.47
DVDD: P1.35 P1.49 P2.23 P3.34 P3.39 ; sheet LDO/DVDD
EN_HFIR: P1.31 R061.1
EN_pseudo: P1.43 R033.1
EN_sensor: P1.42 R025.1
ESDVDD: P2.6 ; sheet LDO/ESDVDD
fLO: J_demod.1 R029.1
FPGAVDD: BKconnector.35(+VCCO1) BKconnector.55(+VCCO1) BKconnector.116(+VCCO0) BKconnector.136(+VCCO0) J_FPGAVDD.1 ; sheet Level_Shifter_Clk/FPGAVDD, sheet Level_Shifter_Stripline/FPGAVDD
Gain2X: P1.38 R043.1
GMR_Sel0: R095.1 U0.17(A0)
GMR_Sel1: R097.1 U0.16(A1)
GMR_Sel2: R099.1 U0.15(A2)
GMR_Sel3: R101.1 U0.14(A3)
Iunit: J_Bin5.2 P3.8 R_Iunit.1
L_Sb: P1.46 R023.1
Mux_A0: J1.17 J_Mux1_A0.1 J_Mux2_A0.1 J_Mux3_A0.1 J_Mux4_A0.1 J_Mux5_A0.1 J_Mux6_A0.1 J_Mux7_A0.1
Mux_A1: J1.49 J_Mux1_A1.2 J_Mux2_A1.2 J_Mux3_A1.2 J_Mux4_A1.2 J_Mux5_A1.2 J_Mux6_A1.2 J_Mux7_A1.2
Mux_EN: J1.52 J_Mux1_EN.1 J_Mux2_EN.1 J_Mux3_EN.1 J_Mux4_EN.1 J_Mux5_EN.1 J_Mux6_EN.1 J_Mux7_EN.1
R1: J_R1.3 Jr1.1 P20.6 ; sheet Bias_Current_Source/Sensor1
R2: J_R2.3 Jr2.1 P20.5 ; sheet Bias_Current_Source/Sensor2
R3: J_R3.3 Jr3.1 P20.8 ; sheet Bias_Current_Source/Sensor3
R4: J_R4.3 Jr4.1 P20.7 ; sheet Bias_Current_Source/Sensor4
R5: J_R5.3 Jr5.1 P20.18 ; sheet Bias_Current_Source/Sensor5
R6: J_R6.3 Jr6.1 P20.17 ; sheet Bias_Current_Source/Sensor6
R7: J_R7.3 Jr7.1 P20.20 ; sheet Bias_Current_Source/Sensor7
R8: J_R8.3 Jr8.1 P20.19 ; sheet Bias_Current_Source/Sensor8
Rst_counter: P1.28 R067.1
Rst_DSM: P1.30 R059.1
Rst_RS: P1.47 R021.1
Rst_SI_sensor: P1.50 R017.1
Rst_SI_stripe: P3.37 R049.1
Rst_stripe: P3.38 R051.1
SH_LDb_global: P1.26 R071.1
SH_LDb_test: P3.45 R073.1
SO_ctrl0: P3.41 R060.2
SO_ctrl1: P3.42 R062.2
SO_ctrl2: P3.43 R064.2
SO_ctrl3: P3.44 R066.2
SO_EN0: P1.19 R068.2
SO_EN1: P1.20 R070.2
SO_EN2: P1.17 R072.2
SO_EN3: P1.18 R074.2
SO_test: BKconnector.50(N20) P3.46 R050.1
Sout0: BKconnector.42(U20) P1.21 R042.1
Sout1: BKconnector.44(U22) P1.22 R044.1
Sout2: BKconnector.46(R20) P1.23 R046.1
Sout3: BKconnector.48(R22) P1.24 R048.1
SVDD: P2.3 P2.4 ; sheet LDO/SVDD
V_fH: V_fH.1(X) ; sheet Stripline_Driver/V_fH
V_Iunit: J_Bout5.2
Vac+0_buf: AI_Mux1.7(S4A) AI_Mux4.6(S3A) J_Aout13.2
Vac+15_buf: AI_Mux2.7(S4A) AI_Mux5.6(S3A) J_Aout14.2
Vac+31_buf: AI_Mux3.7(S4A) AI_Mux6.6(S3A) J_Aout15.2
Vac+<0>: J_Ain13.2 P3.25
Vac+<1>: J_Ain14.2 P3.23
Vac+<2>: J_Ain15.2 P3.21
Vac+_test: J_Ain21.2 P3.17
Vac+test_buf: J_Aout21.2
Vac-0_buf: AI_Mux1.10(S4B) AI_Mux4.11(S3B) J_Bout13.2
Vac-15_buf: AI_Mux2.10(S4B) AI_Mux5.11(S3B) J_Bout14.2
Vac-31_buf: AI_Mux3.10(S4B) AI_Mux6.11(S3B) J_Bout15.2
Vac-<0>: J_Bin13.2 P3.26
Vac-<1>: J_Bin14.2 P3.24
Vac-<2>: J_Bin15.2 P3.22
Vac-_test: J_Bin21.2 P3.18
Vac-test_buf: J_Bout21.2
Vbias: J1.22 J_Vin.2
VbiasL: J_Vbias.1 J_Vin.1 P2.7
VbiasS: J_Vbias.3 J_Vin.3 P2.8
Vcmi: P3.1 ; sheet CM Voltage Generator/Vcmi
Vcmo: P3.2 ; sheet CM Voltage Generator/Vcmo
VDD_Bias: P2.9 P3.7 ; sheet LDO/VDD_Bias
VDD_chip: sheet LDO/VDD_chip, sheet CM Voltage Generator/VDD_chip
VDD_DSM: P1.36 P3.5 ; sheet LDO/VDD_DSM, sheet CM Voltage Generator/VDD_DSM
VDD_IA: P1.37 P3.6 ; sheet LDO/VDD_IA
VDDD: J_VDDD.2 ; sheet Stripline_Driver/VDDD
Vfield: J1.21 J_Vfield.1
VH: J_Vfield.2 J_VH.2 P2.2
VH0: J_VH.1 ; sheet Stripline_Driver/VH0
VIA+0_buf: AI_Mux1.5(S2A) AI_Mux1.6(S3A) J_Aout6.2
VIA+5_buf: AI_Mux2.5(S2A) J_Aout7.2
VIA+10_buf: AI_Mux3.5(S2A) J_Aout8.2
VIA+15_buf: AI_Mux2.6(S3A) AI_Mux4.5(S2A) J_Aout9.2
VIA+20_buf: AI_Mux5.5(S2A) J_Aout10.2
VIA+25_buf: AI_Mux6.5(S2A) J_Aout11.2
VIA+31_buf: AI_Mux3.6(S3A) AI_Mux7.5(S2A) J_Aout12.2
VIA+<0>: J_Ain6.2 P2.10
VIA+<5>: J_Ain7.2 P2.14
VIA+<10>: J_Ain8.2 P2.18
VIA+<15>: J_Ain9.2 P2.22
VIA+<20>: J_Ain10.2 P2.11
VIA+<25>: J_Ain11.2 P2.15
VIA+<31>: J_Ain12.2 P2.19
VIA+_test: J_Ain20.2 P3.15
VIA+test_buf: AI_Mux7.6(S3A) J_Aout20.2
VIA-0_buf: AI_Mux1.11(S3B) AI_Mux1.12(S2B) J_Bout6.2
VIA-5_buf: AI_Mux2.12(S2B) J_Bout7.2
VIA-10_buf: AI_Mux3.12(S2B) J_Bout8.2
VIA-15_buf: AI_Mux2.11(S3B) AI_Mux4.12(S2B) J_Bout9.2
VIA-20_buf: AI_Mux5.12(S2B) J_Bout10.2
VIA-25_buf: AI_Mux6.12(S2B) J_Bout11.2
VIA-31_buf: AI_Mux3.11(S3B) AI_Mux7.12(S2B) J_Bout12.2
VIA-<0>: J_Bin6.2 P2.12
VIA-<5>: J_Bin7.2 P2.16
VIA-<10>: J_Bin8.2 P2.20
VIA-<15>: J_Bin9.2 P2.24
VIA-<20>: J_Bin10.2 P2.13
VIA-<25>: J_Bin11.2 P2.17
VIA-<31>: J_Bin12.2 P2.21
VIA-_test: J_Bin20.2 P3.16
VIA-test_buf: AI_Mux7.11(S3B) J_Bout20.2
VIA_cmi+_test: J_Ain23.2 P3.13
VIA_cmi+test_buf: AI_Mux7.7(S4A) J_Aout23.2
VIA_cmi-_test: J_Bin23.2 P3.14
VIA_cmi-test_buf: AI_Mux7.10(S4B) J_Bout23.2
Vin+0_buf: AI_Mux1.4(S1A) J_Aout2.2
Vin+5_buf: AI_Mux2.4(S1A) J_Bout2.2
Vin+10_buf: AI_Mux3.4(S1A) J_Aout3.2
Vin+15_buf: AI_Mux4.4(S1A) J_Bout3.2
Vin+20_buf: AI_Mux5.4(S1A) J_Aout4.2
Vin+25_buf: AI_Mux6.4(S1A) J_Bout4.2
Vin+31_buf: AI_Mux7.4(S1A) J_Aout5.2
Vin+<0>: J_Ain2.2 J_R2.2 P1.60
Vin+<5>: J_Bin2.2 J_R3.2 P1.57
Vin+<10>: J_Ain3.2 J_R4.2 P1.58
Vin+<15>: J_Bin3.2 J_R5.2 P1.55
Vin+<20>: J_Ain4.2 J_R6.2 P1.56
Vin+<25>: J_Bin4.2 J_R7.2 P1.53
Vin+<31>: J_Ain5.2 J_R8.2 P1.54
Vin+_test: J_Ain19.2 P3.11
Vin+test_buf: J_Aout19.2
Vin-1: J_Bin1.2 J_R1.2 P1.59
Vin-_buf: AI_Mux1.13(S1B) AI_Mux2.13(S1B) AI_Mux3.13(S1B) AI_Mux4.13(S1B) AI_Mux5.13(S1B) AI_Mux6.13(S1B) AI_Mux7.13(S1B) J_Bout1.2
Vin-_test: J_Bin19.2 P3.12
Vin-test_buf: J_Bout19.2
Vout+0_buf: AI_Mux4.7(S4A) J_Aout16.2
Vout+15_buf: AI_Mux5.7(S4A) J_Aout17.2
Vout+31_buf: AI_Mux6.7(S4A) J_Aout18.2
Vout+<0>: J_Ain16.2 P3.31
Vout+<1>: J_Ain17.2 P3.29
Vout+<2>: J_Ain18.2 P3.27
Vout+_test: J_Ain22.2 P3.19
Vout+test_buf: J_Aout22.2
Vout-0_buf: AI_Mux4.10(S4B) J_Bout16.2
Vout-15_buf: AI_Mux5.10(S4B) J_Bout17.2
Vout-31_buf: AI_Mux6.10(S4B) J_Bout18.2
Vout-<0>: J_Bin16.2 P3.32
Vout-<1>: J_Bin17.2 P3.30
Vout-<2>: J_Bin18.2 P3.28
Vout-_test: J_Bin22.2 P3.20
Vout-test_buf: J_Bout22.2
Vref+: P3.3 ; sheet CM Voltage Generator/Vref+
Vref-: P3.4 ; sheet CM Voltage Generator/Vref-
VSSS: Cd02.2 Cd04.2 VSSS.1(X) ; sheet Stripline_Driver/VSSS
Vstripe: J_Ain1.2 P2.1
Vstripe_buf: J1.68 J_Aout1.2
NetAI_Mux1_1: AI_Mux1.1(A0) J_Mux1_A0.2
NetAI_Mux1_2: AI_Mux1.2(EN) J_Mux1_EN.2
NetAI_Mux1_8: AI_Mux1.8(DA) R_AI1.2
NetAI_Mux1_9: AI_Mux1.9(DB) R_AI1b.1
NetAI_Mux1_16: AI_Mux1.16(A1) J_Mux1_A1.1
NetAI_Mux2_1: AI_Mux2.1(A0) J_Mux2_A0.2
NetAI_Mux2_2: AI_Mux2.2(EN) J_Mux2_EN.2
NetAI_Mux2_8: AI_Mux2.8(DA) R_AI2.2
NetAI_Mux2_9: AI_Mux2.9(DB) R_AI2b.1
NetAI_Mux2_16: AI_Mux2.16(A1) J_Mux2_A1.1
NetAI_Mux3_1: AI_Mux3.1(A0) J_Mux3_A0.2
NetAI_Mux3_2: AI_Mux3.2(EN) J_Mux3_EN.2
NetAI_Mux3_8: AI_Mux3.8(DA) R_AI3.2
NetAI_Mux3_9: AI_Mux3.9(DB) R_AI3b.1
NetAI_Mux3_16: AI_Mux3.16(A1) J_Mux3_A1.1
NetAI_Mux4_1: AI_Mux4.1(A0) J_Mux4_A0.2
NetAI_Mux4_2: AI_Mux4.2(EN) J_Mux4_EN.2
NetAI_Mux4_8: AI_Mux4.8(DA) R_AI4.2
NetAI_Mux4_9: AI_Mux4.9(DB) R_AI4b.1
NetAI_Mux4_16: AI_Mux4.16(A1) J_Mux4_A1.1
NetAI_Mux5_1: AI_Mux5.1(A0) J_Mux5_A0.2
NetAI_Mux5_2: AI_Mux5.2(EN) J_Mux5_EN.2
NetAI_Mux5_8: AI_Mux5.8(DA) R_AI5.2
NetAI_Mux5_9: AI_Mux5.9(DB) R_AI5b.1
NetAI_Mux5_16: AI_Mux5.16(A1) J_Mux5_A1.1
NetAI_Mux6_1: AI_Mux6.1(A0) J_Mux6_A0.2
NetAI_Mux6_2: AI_Mux6.2(EN) J_Mux6_EN.2
NetAI_Mux6_8: AI_Mux6.8(DA) R_AI6.2
NetAI_Mux6_9: AI_Mux6.9(DB) R_AI6b.1
NetAI_Mux6_16: AI_Mux6.16(A1) J_Mux6_A1.1
NetAI_Mux7_1: AI_Mux7.1(A0) J_Mux7_A0.2
NetAI_Mux7_2: AI_Mux7.2(EN) J_Mux7_EN.2
NetAI_Mux7_8: AI_Mux7.8(DA) R_AI7.2
NetAI_Mux7_9: AI_Mux7.9(DB) R_AI7b.1
NetAI_Mux7_16: AI_Mux7.16(A1) J_Mux7_A1.1
NetBKconnector_15: BKconnector.15(G16) R015.2
NetBKconnector_17: BKconnector.17(G17) R017.2
NetBKconnector_19: BKconnector.19(H19) R019.2
NetBKconnector_21: BKconnector.21(H18) R021.2
NetBKconnector_23: BKconnector.23(F16) R023.2
NetBKconnector_25: BKconnector.25(F17) R025.2
NetBKconnector_29: BKconnector.29(K17) R029.2
NetBKconnector_31: BKconnector.31(K16) R031.2
NetBKconnector_33: BKconnector.33(J16) R033.2
NetBKconnector_37: BKconnector.37(V21) R037.2
NetBKconnector_41: BKconnector.41(T21) R041.2
NetBKconnector_43: BKconnector.43(T22) R043.2
NetBKconnector_49: BKconnector.49(M21) R049.2
NetBKconnector_51: BKconnector.51(M22) R051.2
NetBKconnector_53: BKconnector.53(L20) R053.2
NetBKconnector_54: BKconnector.54(M20) R054.1
NetBKconnector_57: BKconnector.57(L22) R057.2
NetBKconnector_59: BKconnector.59(H21) R059.2
NetBKconnector_60: BKconnector.60(K21) R060.1
NetBKconnector_61: BKconnector.61(H22) R061.2
NetBKconnector_62: BKconnector.62(K22) R062.1
NetBKconnector_63: BKconnector.63(F21) R063.2
NetBKconnector_64: BKconnector.64(G20) R064.1
NetBKconnector_65: BKconnector.65(F22) R065.2
NetBKconnector_66: BKconnector.66(G22) R066.1
NetBKconnector_67: BKconnector.67(D21) R067.2
NetBKconnector_68: BKconnector.68(E20) R068.1
NetBKconnector_69: BKconnector.69(D22) R069.2
NetBKconnector_70: BKconnector.70(E22) R070.1
NetBKconnector_71: BKconnector.71(B21) R071.2
NetBKconnector_72: BKconnector.72(C20) R072.1
NetBKconnector_73: BKconnector.73(B22) R073.2
NetBKconnector_74: BKconnector.74(C22) R074.1
NetBKconnector_75: BKconnector.75(A21) R075.2
NetBKconnector_87: BKconnector.87(+1.8VDD) J_FPGAVDD.2
NetBKconnector_95: BKconnector.95(W20) R095.2
NetBKconnector_97: BKconnector.97(W22) R097.2
NetBKconnector_99: BKconnector.99(U19) R099.2
NetBKconnector_101: BKconnector.101(V20) R101.2
NetCd01_1: Cd01.1 Cd03.2 J_VDDD.1 VDDD.1(X)
NetJ_att1_1: J_att1.1 ; sheet Attenuator/Vatt1
NetJ_att2_1: J_att2.1 ; sheet Attenuator/Vatt2
NetJ_att3_1: J_att3.1 ; sheet Attenuator/Vatt3
NetJ_att4_1: J_att4.1 ; sheet Attenuator/Vatt4
NetJ_demod_3: J_demod.3 V_demod.1(X)
NetJ_GMR_EN_2: J_GMR_EN.2 U0.18(EN)
NetJ_R1_1: J_R1.1 Rr1.1
NetJ_R2_1: J_R2.1 Rr2.1
NetJ_R3_1: J_R3.1 Rr3.1
NetJ_R4_1: J_R4.1 Rr4.1
NetJ_R5_1: J_R5.1 Rr5.1
NetJ_R6_1: J_R6.1 Rr6.1
NetJ_R7_1: J_R7.1 Rr7.1
NetJ_R8_1: J_R8.1 Rr8.1
NetJ_Vbias_2: J_Vbias.2 Vbias.1(X)
NetU1_2: Vbias2.1(X) ; sheet Bias_Current_Source/Vbias

Not connected (* = marked no-connect by the designer): BKconnector 2(+3.3VDD) 3(-) 4(+3.3VDD) 5(JTAG_TCK) 6(+3.3VDD) 7(JTAG_TMS) 8(JTAG_TDO) 9(JTAG_TDI) 10(VREF_1) 11(SYS_CLK4) 12(-) 27(J17) 34(L15) 38(K20) 39(V22) 40(K19) 45(P21) 47(P22) 52(N22) 58(L19) 76(A20) 77(J20) 79(J22) 81(+VDC) 83(+VDC) 84(+1.2VDD) 85(+VDC) 86(+1.2VDD) 88(SYS_CLK5) 89(+3.3VDD) 90(USB_SCL) 91(+3.3VDD) 92(USB_SDA) 93(+3.3VDD); J1 1 2 3 5 6 8 10 11 14 16 19 20 37 38 39 40 41 42 43 45 46 47 48 51 69(MH1) 70(MH2); P20 3 4; U0 2(NC) 3(NC) 4(S16) 5(S15) 6(S14) 7(S13) 8(S12) 9(S11) 13(NC)

### Buses and harness runs
bus A_IN[1..23]
bus A_OUT[1..23]
bus B_IN[1..23]
bus B_OUT[1..23]

### Notes on the sheet
- (near P20) Header20 for ribbon cable
- (in symbol OpalKelly_XEM6010) JP2 on OK6010 = bottom connector; JP3 on OK6010 = top connector; Bank0

### Library data of the parts
C_AI1 C_AI1b C_AI2 C_AI2b C_AI3 C_AI3b C_AI4 C_AI4b C_AI5 C_AI5b C_AI6 C_AI6b C_AI7 C_AI7b Cd03 Cd04 Cd51-Cd66 = Cap: Capacitor; Published: 8-Jun-2000; LatestRevisionDate: 17-Jul-2002; LatestRevisionNote: Re-released for DXP Platform.; PackageReference: RAD-0.3; Publisher: Altium Limited; PackageDescription: Radial Cap, Thru-Hole; 2 Leads; 0.3 in Pin Spacing
  C_AI1 C_AI1b C_AI2 C_AI2b C_AI3 C_AI3b C_AI4 C_AI4b C_AI5 C_AI5b C_AI6 C_AI6b C_AI7 C_AI7b Cd51-Cd66: Digi-Key: 445-7534-1-ND
  Cd03 Cd04: Digikey PN: 445-1419-1-ND
Cd01 Cd02 = Cap Pol1: Polarized Capacitor (Radial); Published: 8-Jun-2000; LatestRevisionDate: 17-Jul-2002; LatestRevisionNote: Re-released for DXP Platform.; PackageReference: RB7.6-15; Publisher: Altium Limited; PackageDescription: Polarized Capacitor (Radial); 2 Leads; Digikey PN: 478-3349-1-ND
FB1 = Inductor: Manufacturer: Wurth Electronics Inc; Manufacturer Part Number: 742792093; Code_IEC: 1005; Value: 10mH; Impedance @ Frequency: 2.2 kOhm @ 100MHz; Current Rating: 200mA; DC Resistance (DCR): 600 mOhm Max; Filter Type: Differential Mode - Single; Published: 8-Jun-2000; LatestRevisionDate: 29-May-2009; LatestRevisionNote: IPC-7351 Footprint Added.; PackageReference: 0402-A; Publisher: Altium Limited; PackageDescription: Chip Inductor; Code_JEITA: 0402; Supplier 1: Digi-Key; RoHS: RoHS Compliant; Category: Filters; Stock 1: 48274; Pricing 1: 1=0.23, 50=0.2188, 100=0.2013, 500=0.1925, 1000=0.18375, 2000=0.175 (USD); Packaging: Cut Tape (CT); Package / Case: 0805 (2012 Metric); Mounting Type: Surface Mount; Height (Max): 0.043" (1.10mm); Size / Dimension: 0.079" L x 0.047" W (2.00mm x 1.20mm); ComponentLink1URL: http://katalog.we-online.de/pbs/datasheet/742792093.pdf; ComponentLink1Description: http://katalog.we-online.de/pbs/datasheet/742792093.pdf
H1-H8 = MTHole
J1 = 2-174225-5: Cap Header, Right Angle /M2.5 AMPLIMITE 050 Series II; Positions: 68; Gender: Plug Header; Note: With Mating Lock; PCB_Layout: Complies with manufacturer's recommendation.; DrillSize: Corresponds to nominal value.; Published: 17-Jul-2002; DatasheetDocument: May-1991; PackageDocument: 23-May-1991; PackageReference: 2-174225-5; Publisher: Altium Limited; Orientation: Right Angle; Note: Series II; ComponentLink1Description: Manufacturer Link; ComponentLink1URL: http://www.tycoelectronics.com/; ComponentLink2Description: Packaging Specification; ComponentLink2URL: http://ecommas.tycoelectronics.com/commerce/DocumentDelivery/DDEController?Action=showdoc&DocId=Customer+Drawing%7F174225%7FD%7Fpdf%7FJapanese%7FJPN_CD_174225_D.pdf; ComponentLink3Description: Iges Model; ComponentLink3URL: http://catalog.tycoelectronics.com/TE/docs/cadgeo/0/91/40190.tar.gz
J_Ain1-J_Ain23 J_Aout1-J_Aout23 J_Bin1-J_Bin23 J_Bout1-J_Bout23 J_FPGAVDD J_Mux1_A0 J_Mux1_A1 J_Mux1_EN J_Mux2_A0 J_Mux2_A1 J_Mux2_EN J_Mux3_A0 J_Mux3_A1 J_Mux3_EN J_Mux4_A0 J_Mux4_A1 J_Mux4_EN J_Mux5_A0 J_Mux5_A1 J_Mux5_EN J_Mux6_A0 J_Mux6_A1 J_Mux6_EN J_Mux7_A0 J_Mux7_A1 J_Mux7_EN J_Vfield J_VH = Header 2: Header, 2-Pin; LatestRevisionDate: 17-Jul-2002; LatestRevisionNote: Re-released for DXP Platform.; Publisher: Altium Limited
J_demod J_GMR_EN J_R1-J_R8 J_Vbias J_VDDD J_Vin = Header 3: Header, 3-Pin; LatestRevisionDate: 17-Jul-2002; LatestRevisionNote: Re-released for DXP Platform.; Publisher: Altium Limited
P1-P3 = Header 30X2: Header, 30-Pin, Dual row; LatestRevisionDate: 17-Jul-2002; LatestRevisionNote: Re-released for DXP Platform.; Publisher: Altium Limited
P20 = Header 20: Header, 20-Pin; Manufacturer: 3M; Manufacturer Part Number: N3428-6203RB; Connector Type: Header, Shrouded; Number of Positions: 20; Number of Positions Loaded: All; Pitch: 0.100" (2.54mm); LatestRevisionDate: 17-Jul-2002; LatestRevisionNote: Re-released for DXP Platform.; Publisher: Altium Limited; Supplier 1: Digi-Key; RoHS: RoHS Compliant; Category: Connectors, Interconnects; Stock 1: 110; Pricing 1: 1=3.25, 10=3.12, 25=2.86, 50=2.73, 100=2.6, 250=2.275, 500=2.21, 1000=1.885, 2500=1.755 (USD); Packaging: Bulk; Contact Type: Male Pin; Number of Rows: 2; Row Spacing: 0.100" (2.54mm); Contact Mating Length: 0.240" (6.10mm); Mounting Type: Through Hole; Termination: Solder; Fastening Type: Latch, Short/Eject Hooks; Features: -; Contact Finish: Gold; Contact Finish Thickness: 30µin (0.76µm); Color: Black; ComponentLink1URL: http://multimedia.3m.com/mws/mediawebserver?66666UuZjcFSLXTt4Xfym8s6EVuQEcuZgVs6EVs6E666666--; ComponentLink1Description: http://multimedia.3m.com/mws/mediawebserver?66666UuZjcFSLXTt4Xfym8s6EVuQEcuZgVs6EVs6E666666--
R015 R017 R019 R021 R023 R025 R029 R031 R033 R037 R041 R042 R043 R044 R046 R048 R049 R050 R051 R053 R054 R057 R059 R060 R061 R062 R063 R064 R065 R066 R067 R068 R069 R070 R071 R072 R073 R074 R075 R095 R097 R099 R101 R_AI1 R_AI1b R_AI2 R_AI2b R_AI3 R_AI3b R_AI4 R_AI4b R_AI5 R_AI5b R_AI6 R_AI6b R_AI7 R_AI7b R_Iunit RC1-RC10 Rr1-Rr8 = Res1: Resistor; Published: 8-Jun-2000; LatestRevisionDate: 17-Jul-2002; LatestRevisionNote: Re-released for DXP Platform.; PackageReference: AXIAL-0.3; Publisher: Altium Limited; PackageDescription: Axial Device, Thru-Hole; 2 Leads; 0.3 in Pin Spacing; Digikey PN: P1.00KCCT-ND
U0 = ADG706BRUZ: 1.8 to 5.5 V / 2.5 V, CMOS Low-Voltage 2.5 Ohm, 16-Channel Multiplexer, -40 to 85 degC, 28-pin SOP (RU-28), Tube; Manufacturer: Analog Devices; Bandwidth (Hz): 25M; Max Analog Signal Range: Vss to Vdd; Ron (ohms): 2.5; Supply V Guar Performance: Dual_(+/-2.5V), Single_(+3V), Single_(+5V); t transition (s): 40n; DatasheetVersion: Rev. A; PackageVersion: Mar-05; PackageReference: RU-28; PackageDescription: 28-Pin Thin Shrink Small Outline Package, Body 9.7 x 4.4 mm, Pitch 0.65 mm; Supplier 1: Digi-Key; Supplier Part Number 1: ADG706BRUZ-ND; Supplier 2: Farnell; Supplier Part Number 2: 9604332; Supplier 3: Newark; Supplier Part Number 3: 19M0682; Supplier 4: Mouser; Supplier Part Number 4: 584-ADG706BRUZ; Packing: Tube; Mounting Technology: Surface Mount; Code_JEDEC: MO-153-AE; PartNumber: ADG706BRUZ; ComponentLink1Description: Manufacturer URL; ComponentLink1URL: http://www.analog.com/en/index.html; ComponentLink2Description: Datasheet; ComponentLink2URL: http://www.analog.com/static/imported-files/data_sheets/ADG706_707.pdf; ComponentLink3Description: Package Specification; ComponentLink3URL: http://www.analog.com/static/imported-files/packages/249854663RU_28.pdf
V_demod V_fH Vbias Vbias2 VDDD VSSS = SMB: SMB Straight Connector; LatestRevisionDate: 17-Jul-2002; LatestRevisionNote: Re-released for DXP Platform.; Publisher: Altium Limited
J_att1-J_att4 Jr1-Jr8 = Socket: LatestRevisionDate: 17-Jul-2002; LatestRevisionNote: Re-released for DXP Platform.; Publisher: Altium Limited

## Sheet LDO.SchDoc
size 304 x 254 mm
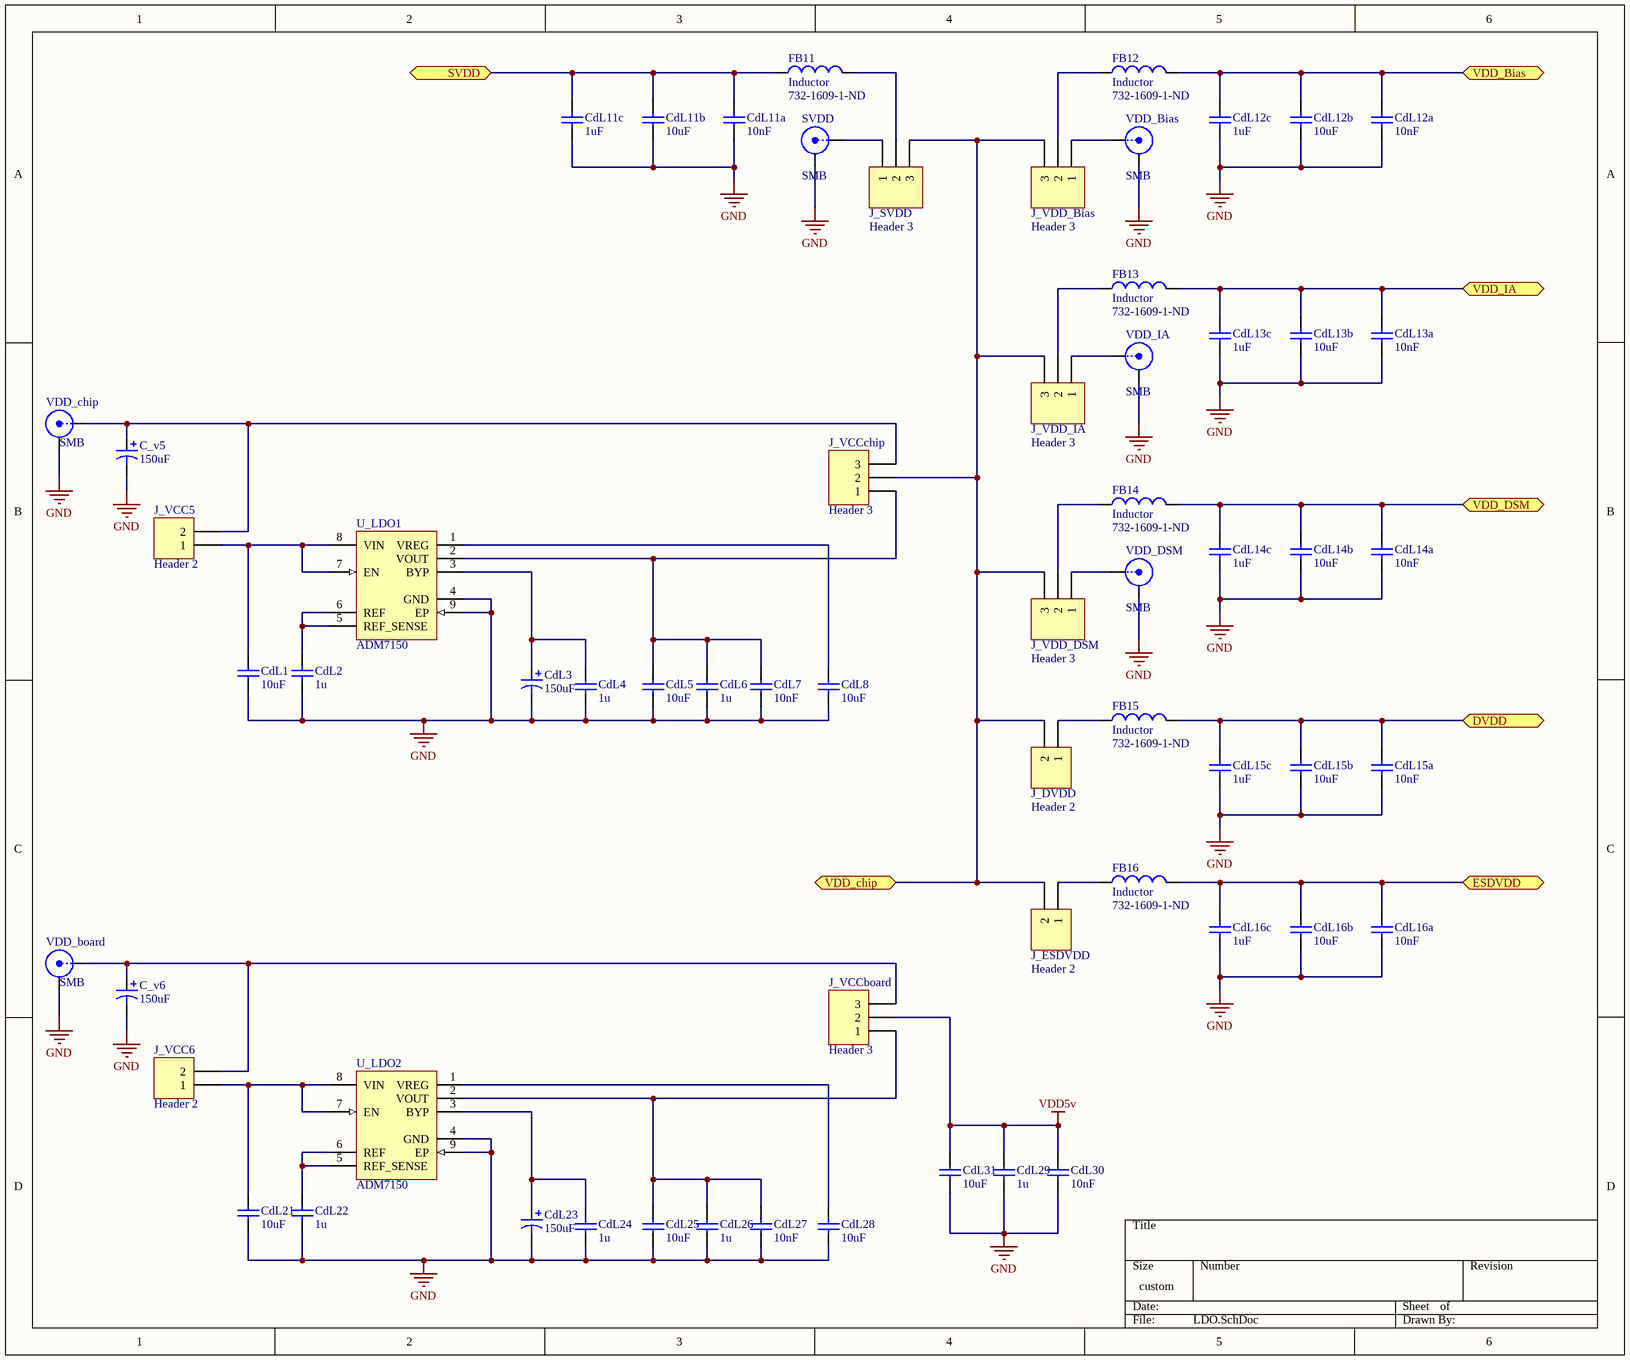
[diagram p4: LDO.SchDoc]

### Parts
C_v5  value 150uF  [C1210_M]  (hidden comment: Cap Pol1)
C_v6  value 150uF  [C1210_M]  (hidden comment: Cap Pol1)
CdL1  value 10uF  [6-0805_M]  (hidden comment: Cap)
CdL2  value 1u  [6-0805_M]  (hidden comment: Cap)
CdL3  value 150uF  [C1210_M]  (hidden comment: Cap Pol1)
CdL4  value 1u  [6-0805_M]  (hidden comment: Cap)
CdL5  value 10uF  [6-0805_M]  (hidden comment: Cap)
CdL6  value 1u  [6-0805_M]  (hidden comment: Cap)
CdL7  value 10nF  [6-0805_M]  (hidden comment: Cap)
CdL8  value 10uF  [6-0805_M]  (hidden comment: Cap)
CdL11a  value 10nF  [1608[0603]]  (hidden comment: Cap)
CdL11b  value 10uF  [1608[0603]]  (hidden comment: Cap)
CdL11c  value 1uF  [1608[0603]]  (hidden comment: Cap)
CdL12a  value 10nF  [1608[0603]]  (hidden comment: Cap)
CdL12b  value 10uF  [1608[0603]]  (hidden comment: Cap)
CdL12c  value 1uF  [1608[0603]]  (hidden comment: Cap)
CdL13a  value 10nF  [1608[0603]]  (hidden comment: Cap)
CdL13b  value 10uF  [1608[0603]]  (hidden comment: Cap)
CdL13c  value 1uF  [1608[0603]]  (hidden comment: Cap)
CdL14a  value 10nF  [1608[0603]]  (hidden comment: Cap)
CdL14b  value 10uF  [1608[0603]]  (hidden comment: Cap)
CdL14c  value 1uF  [1608[0603]]  (hidden comment: Cap)
CdL15a  value 10nF  [1608[0603]]  (hidden comment: Cap)
CdL15b  value 10uF  [1608[0603]]  (hidden comment: Cap)
CdL15c  value 1uF  [1608[0603]]  (hidden comment: Cap)
CdL16a  value 10nF  [1608[0603]]  (hidden comment: Cap)
CdL16b  value 10uF  [1608[0603]]  (hidden comment: Cap)
CdL16c  value 1uF  [1608[0603]]  (hidden comment: Cap)
CdL21  value 10uF  [6-0805_M]  (hidden comment: Cap)
CdL22  value 1u  [6-0805_M]  (hidden comment: Cap)
CdL23  value 150uF  [C1210_M]  (hidden comment: Cap Pol1)
CdL24  value 1u  [6-0805_M]  (hidden comment: Cap)
CdL25  value 10uF  [6-0805_M]  (hidden comment: Cap)
CdL26  value 1u  [6-0805_M]  (hidden comment: Cap)
CdL27  value 10nF  [6-0805_M]  (hidden comment: Cap)
CdL28  value 10uF  [6-0805_M]  (hidden comment: Cap)
CdL29  value 1u  [6-0805_M]  (hidden comment: Cap)
CdL30  value 10nF  [6-0805_M]  (hidden comment: Cap)
CdL31  value 10uF  [6-0805_M]  (hidden comment: Cap)
FB11  Inductor  Supplier Part Number 1: 732-1609-1-ND  [C0805]
FB12  Inductor  Supplier Part Number 1: 732-1609-1-ND  [C0805]
FB13  Inductor  Supplier Part Number 1: 732-1609-1-ND  [C0805]
FB14  Inductor  Supplier Part Number 1: 732-1609-1-ND  [C0805]
FB15  Inductor  Supplier Part Number 1: 732-1609-1-ND  [C0805]
FB16  Inductor  Supplier Part Number 1: 732-1609-1-ND  [C0805]
J_DVDD  Header 2  [HDR1X2]
J_ESDVDD  Header 2  [HDR1X2]
J_SVDD  Header 3  [HDR1X3]
J_VCC5  Header 2  [HDR1X2]
J_VCC6  Header 2  [HDR1X2]
J_VCCboard  Header 3  [HDR1X3]
J_VCCchip  Header 3  [HDR1X3]
J_VDD_Bias  Header 3  [HDR1X3]
J_VDD_DSM  Header 3  [HDR1X3]
J_VDD_IA  Header 3  [HDR1X3]
SVDD  SMB  [SMB_V-RJ45]
U_LDO1  ADM7150  [ADM7150]
U_LDO2  ADM7150  [ADM7150]
VDD_Bias  SMB  [SMB_V-RJ45]
VDD_board  SMB  [SMB_V-RJ45]
VDD_chip  SMB  [SMB_V-RJ45]
VDD_DSM  SMB  [SMB_V-RJ45]
VDD_IA  SMB  [SMB_V-RJ45]

### Ports
DVDD (bidir), ESDVDD (bidir), SVDD (bidir), VDD_Bias (bidir), VDD_chip (bidir), VDD_DSM (bidir), VDD_IA (bidir)

### Nets
GND: C_v5.2 C_v6.2 CdL1.1 CdL2.1 CdL3.2 CdL4.1 CdL5.1 CdL6.1 CdL7.1 CdL8.2 CdL11a.2 CdL11b.2 CdL11c.2 CdL12a.2 CdL12b.2 CdL12c.2 CdL13a.2 CdL13b.2 CdL13c.2 CdL14a.2 CdL14b.2 CdL14c.2 CdL15a.2 CdL15b.2 CdL15c.2 CdL16a.2 CdL16b.2 CdL16c.2 CdL21.1 CdL22.1 CdL23.2 CdL24.1 CdL25.1 CdL26.1 CdL27.1 CdL28.2 CdL29.1 CdL30.1 CdL31.1 SVDD.2(Y) U_LDO1.4(GND) U_LDO1.9(EP) U_LDO2.4(GND) U_LDO2.9(EP) VDD_Bias.2(Y) VDD_board.2(Y) VDD_chip.2(Y) VDD_DSM.2(Y) VDD_IA.2(Y)
VDD5v: CdL29.2 CdL30.2 CdL31.2 J_VCCboard.2
DVDD: CdL15a.1 CdL15b.1 CdL15c.1 FB15.2 ; port DVDD
ESDVDD: CdL16a.1 CdL16b.1 CdL16c.1 FB16.2 ; port ESDVDD
SVDD: CdL11a.1 CdL11b.1 CdL11c.1 FB11.2 ; port SVDD
VDD_Bias: CdL12a.1 CdL12b.1 CdL12c.1 FB12.2 ; port VDD_Bias
VDD_chip: J_DVDD.2 J_ESDVDD.2 J_SVDD.3 J_VCCchip.2 J_VDD_Bias.3 J_VDD_DSM.3 J_VDD_IA.3 ; port VDD_chip
VDD_DSM: CdL14a.1 CdL14b.1 CdL14c.1 FB14.2 ; port VDD_DSM
VDD_IA: CdL13a.1 CdL13b.1 CdL13c.1 FB13.2 ; port VDD_IA
NetC_v5_1: C_v5.1 J_VCC5.2 J_VCCchip.3 VDD_chip.1(X)
NetC_v6_1: C_v6.1 J_VCC6.2 J_VCCboard.3 VDD_board.1(X)
NetCdL1_2: CdL1.2 J_VCC5.1 U_LDO1.7(EN) U_LDO1.8(VIN)
NetCdL2_2: CdL2.2 U_LDO1.5(REF_SENSE) U_LDO1.6(REF)
NetCdL3_1: CdL3.1 CdL4.2 U_LDO1.3(BYP)
NetCdL5_2: CdL5.2 CdL6.2 CdL7.2 J_VCCchip.1 U_LDO1.2(VOUT)
NetCdL8_1: CdL8.1 U_LDO1.1(VREG)
NetCdL21_2: CdL21.2 J_VCC6.1 U_LDO2.7(EN) U_LDO2.8(VIN)
NetCdL22_2: CdL22.2 U_LDO2.5(REF_SENSE) U_LDO2.6(REF)
NetCdL23_1: CdL23.1 CdL24.2 U_LDO2.3(BYP)
NetCdL25_2: CdL25.2 CdL26.2 CdL27.2 J_VCCboard.1 U_LDO2.2(VOUT)
NetCdL28_1: CdL28.1 U_LDO2.1(VREG)
NetFB11_1: FB11.1 J_SVDD.2
NetFB12_1: FB12.1 J_VDD_Bias.2
NetFB13_1: FB13.1 J_VDD_IA.2
NetFB14_1: FB14.1 J_VDD_DSM.2
NetFB15_1: FB15.1 J_DVDD.1
NetFB16_1: FB16.1 J_ESDVDD.1
NetJ_SVDD_1: J_SVDD.1 SVDD.1(X)
NetJ_VDD_Bias_1: J_VDD_Bias.1 VDD_Bias.1(X)
NetJ_VDD_DSM_1: J_VDD_DSM.1 VDD_DSM.1(X)
NetJ_VDD_IA_1: J_VDD_IA.1 VDD_IA.1(X)

### Library data of the parts
C_v5 C_v6 CdL3 CdL23 = Cap Pol1: Polarized Capacitor (Radial); Published: 8-Jun-2000; LatestRevisionDate: 17-Jul-2002; LatestRevisionNote: Re-released for DXP Platform.; PackageReference: RB7.6-15; Publisher: Altium Limited; PackageDescription: Polarized Capacitor (Radial); 2 Leads; Digikey PN: 478-3349-1-ND
CdL1 CdL2 CdL4-CdL8 CdL11a CdL11b CdL11c CdL12a CdL12b CdL12c CdL13a CdL13b CdL13c CdL14a CdL14b CdL14c CdL15a CdL15b CdL15c CdL16a CdL16b CdL16c CdL21 CdL22 CdL24-CdL31 = Cap: Capacitor; Published: 8-Jun-2000; LatestRevisionDate: 17-Jul-2002; LatestRevisionNote: Re-released for DXP Platform.; PackageReference: RAD-0.3; Publisher: Altium Limited; PackageDescription: Radial Cap, Thru-Hole; 2 Leads; 0.3 in Pin Spacing
  CdL1 CdL2 CdL4-CdL8 CdL21 CdL22 CdL24-CdL31: Digikey PN: 445-1419-1-ND
  CdL11a CdL11b CdL11c CdL12a CdL12b CdL12c CdL13a CdL13b CdL13c CdL14a CdL14b CdL14c CdL15a CdL15b CdL15c CdL16a CdL16b CdL16c: Digi-Key: 445-7534-1-ND
FB11-FB16 = Inductor: as FB1 on sheet Top; Published: 8-Jun-2000; LatestRevisionDate: 29-May-2009; LatestRevisionNote: IPC-7351 Footprint Added.; PackageReference: 0402-A; Publisher: Altium Limited; PackageDescription: Chip Inductor; Code_JEITA: 0402; Supplier 1: Digi-Key; RoHS: RoHS Compliant; Category: Filters; Stock 1: 48274; Pricing 1: 1=0.23, 50=0.2188, 100=0.2013, 500=0.1925, 1000=0.18375, 2000=0.175 (USD); Packaging: Cut Tape (CT); Package / Case: 0805 (2012 Metric); Mounting Type: Surface Mount; Height (Max): 0.043" (1.10mm); Size / Dimension: 0.079" L x 0.047" W (2.00mm x 1.20mm); ComponentLink1URL: http://katalog.we-online.de/pbs/datasheet/742792093.pdf; ComponentLink1Description: http://katalog.we-online.de/pbs/datasheet/742792093.pdf
J_DVDD J_ESDVDD J_VCC5 J_VCC6 = Header 2: Header, 2-Pin; LatestRevisionDate: 17-Jul-2002; LatestRevisionNote: Re-released for DXP Platform.; Publisher: Altium Limited
J_SVDD J_VCCboard J_VCCchip J_VDD_Bias J_VDD_DSM J_VDD_IA = Header 3: Header, 3-Pin; LatestRevisionDate: 17-Jul-2002; LatestRevisionNote: Re-released for DXP Platform.; Publisher: Altium Limited
SVDD VDD_Bias VDD_board VDD_chip VDD_DSM VDD_IA = SMB: SMB Straight Connector; LatestRevisionDate: 17-Jul-2002; LatestRevisionNote: Re-released for DXP Platform.; Publisher: Altium Limited
U_LDO1 U_LDO2 = ADM7150: 800 mA Ultralow Noise, High PSRR, RF Linear Regulator; Manufacturer: Analog Devices; PartNumber: ADP1707ARDZ-3.3-R7; Iout max: 1A; Packing: Reel; Preset Vout Values (V): 1.8; Supply Current IGND @ Small Load: 50uA; Vin (max) (V): 5.5; Vin (min) (V): 2.5; DatasheetVersion: Rev. 0; PackageVersion: Jan-05; PackageReference: RD-8-2; PackageDescription: 8-Pin Standard Small Outline Package, Body 4.9 x 3.9 mm, Pitch 1.27 mm; Supplier 1: Digi-Key; Supplier Part Number 1: ADP1707ARDZ-3.3-R7TR-ND; Supplier 2: Digi-Key; Supplier Part Number 2: ADP1707ARDZ-3.3-R7CT-ND; Supplier 3: Digi-Key; Supplier Part Number 3: ADP1707ARDZ-3.3-R7DKR-ND; Supplier 4: Mouser; Supplier Part Number 4: 584-ADP1707ARDZ3.3R7; Mounting Technology: Surface Mount; Code_JEDEC: MS-012-AA; ComponentLink1Description: Manufacturer URL; ComponentLink1URL: http://www.analog.com/en/index.html; ComponentLink2Description: Datasheet; ComponentLink2URL: http://www.analog.com/static/imported-files/data_sheets/ADP1706_1707_1708.pdf; ComponentLink3Description: Package Specification; ComponentLink3URL: http://www.analog.com/static/imported-files/packages/62062404671038RD_8_2.pdf; ComponentLink4Description: URL Link1; ComponentLink4URL: Product URL:http://www.analog.com/en/ADP1707/productSearch.html